# EAGLE board Preselector (EAGLE 7.7.0), part 1 of 2
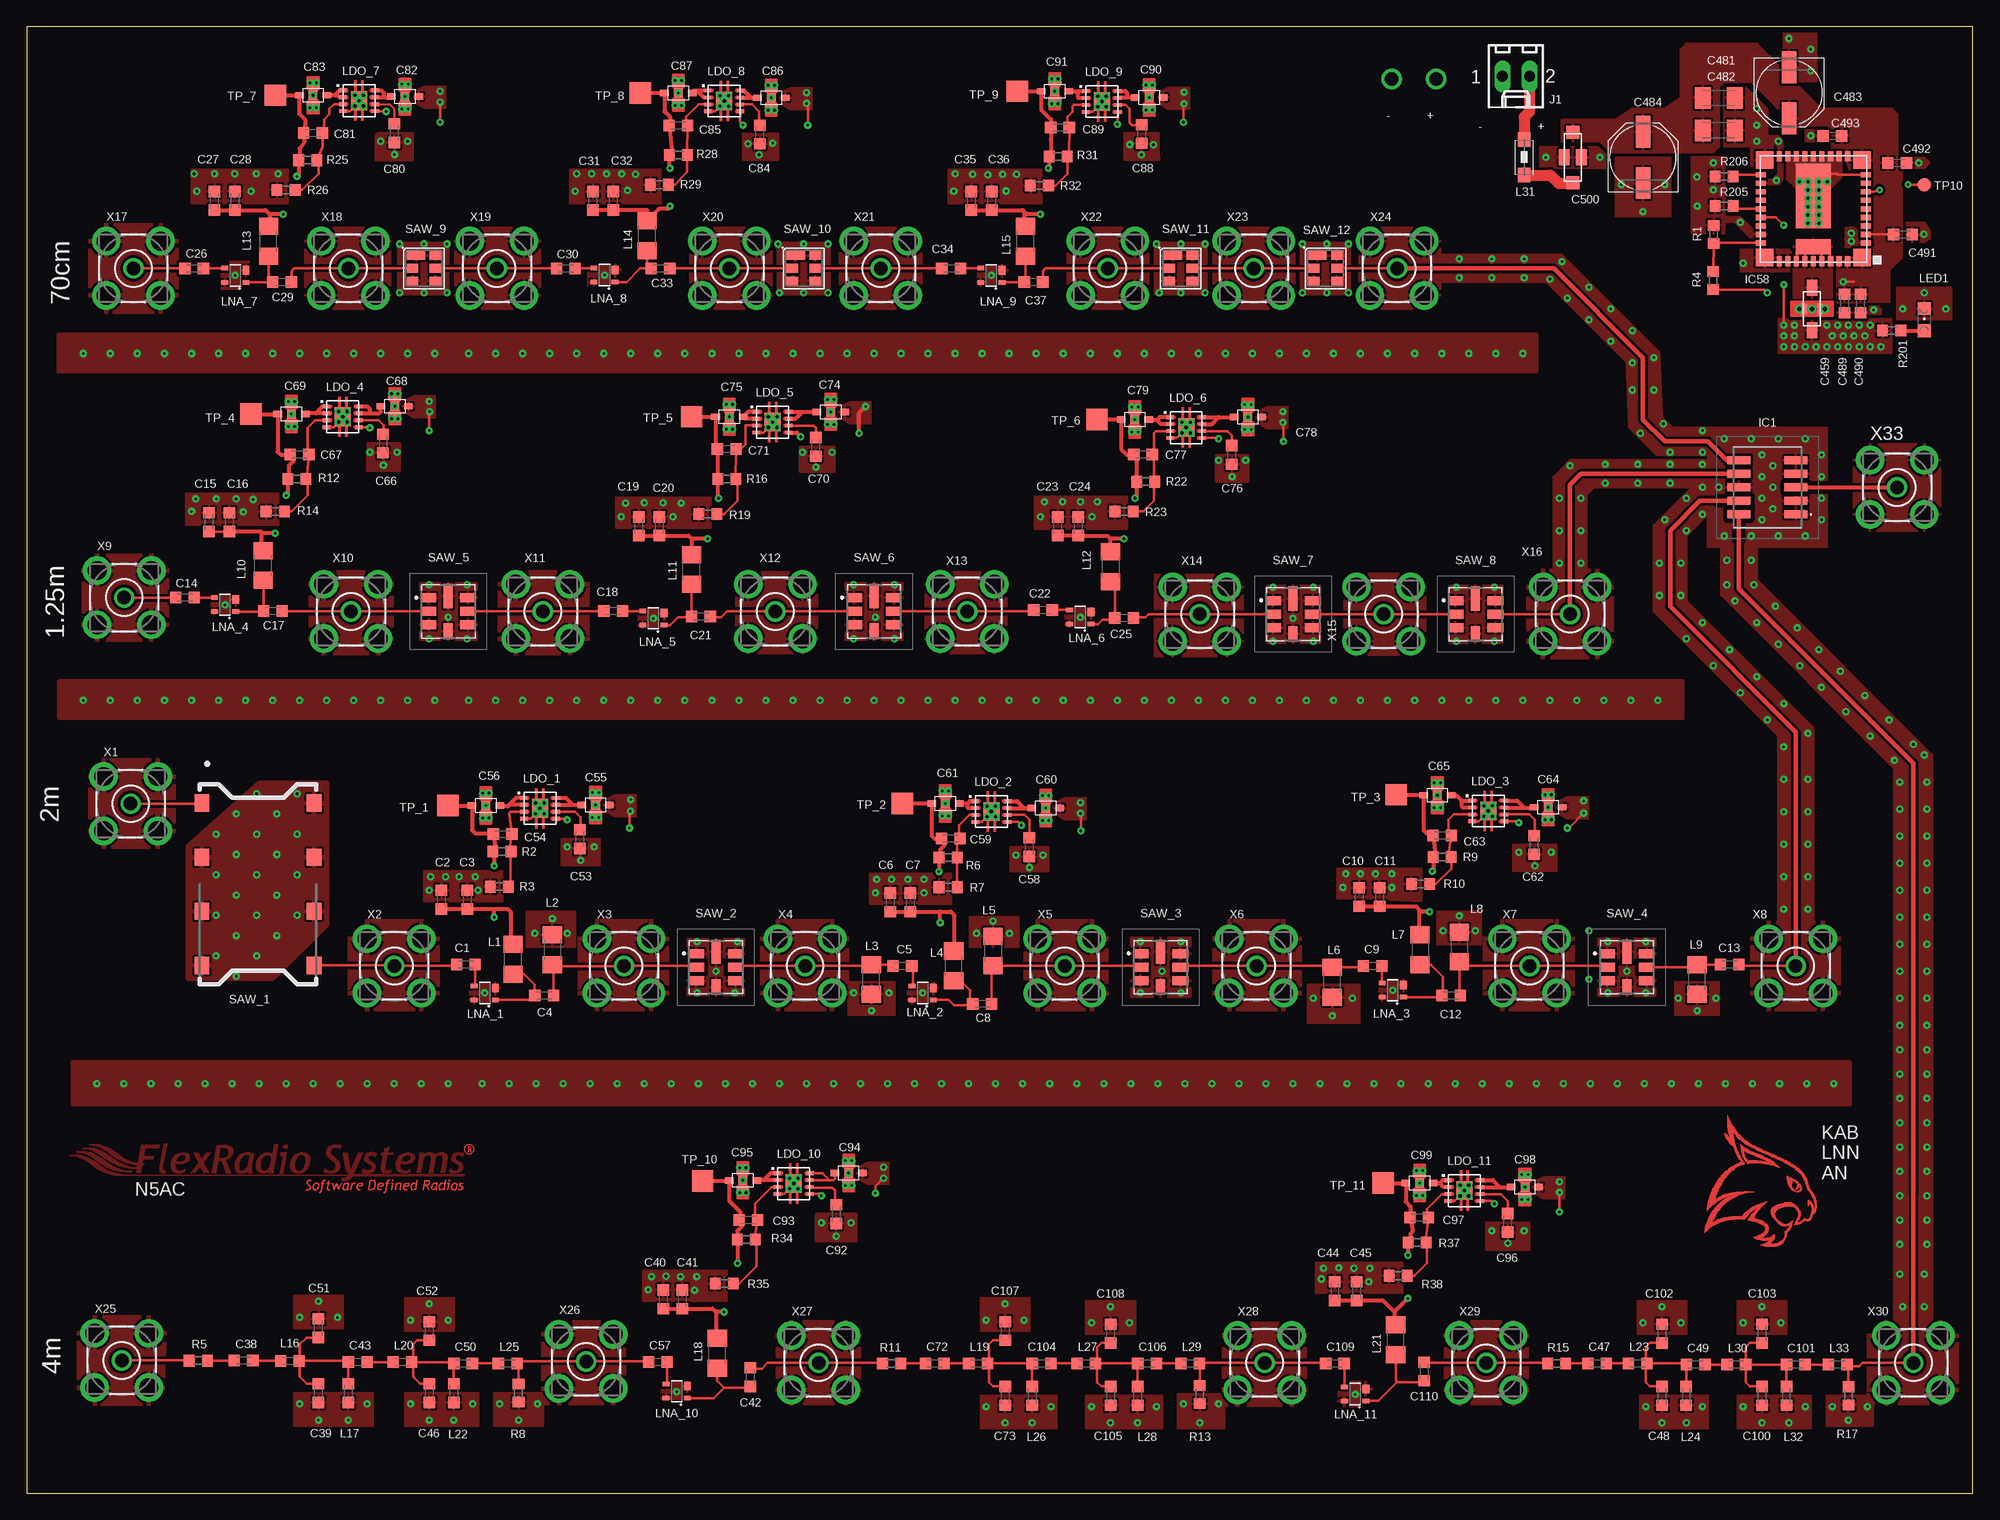
[diagram p5: board, top side]
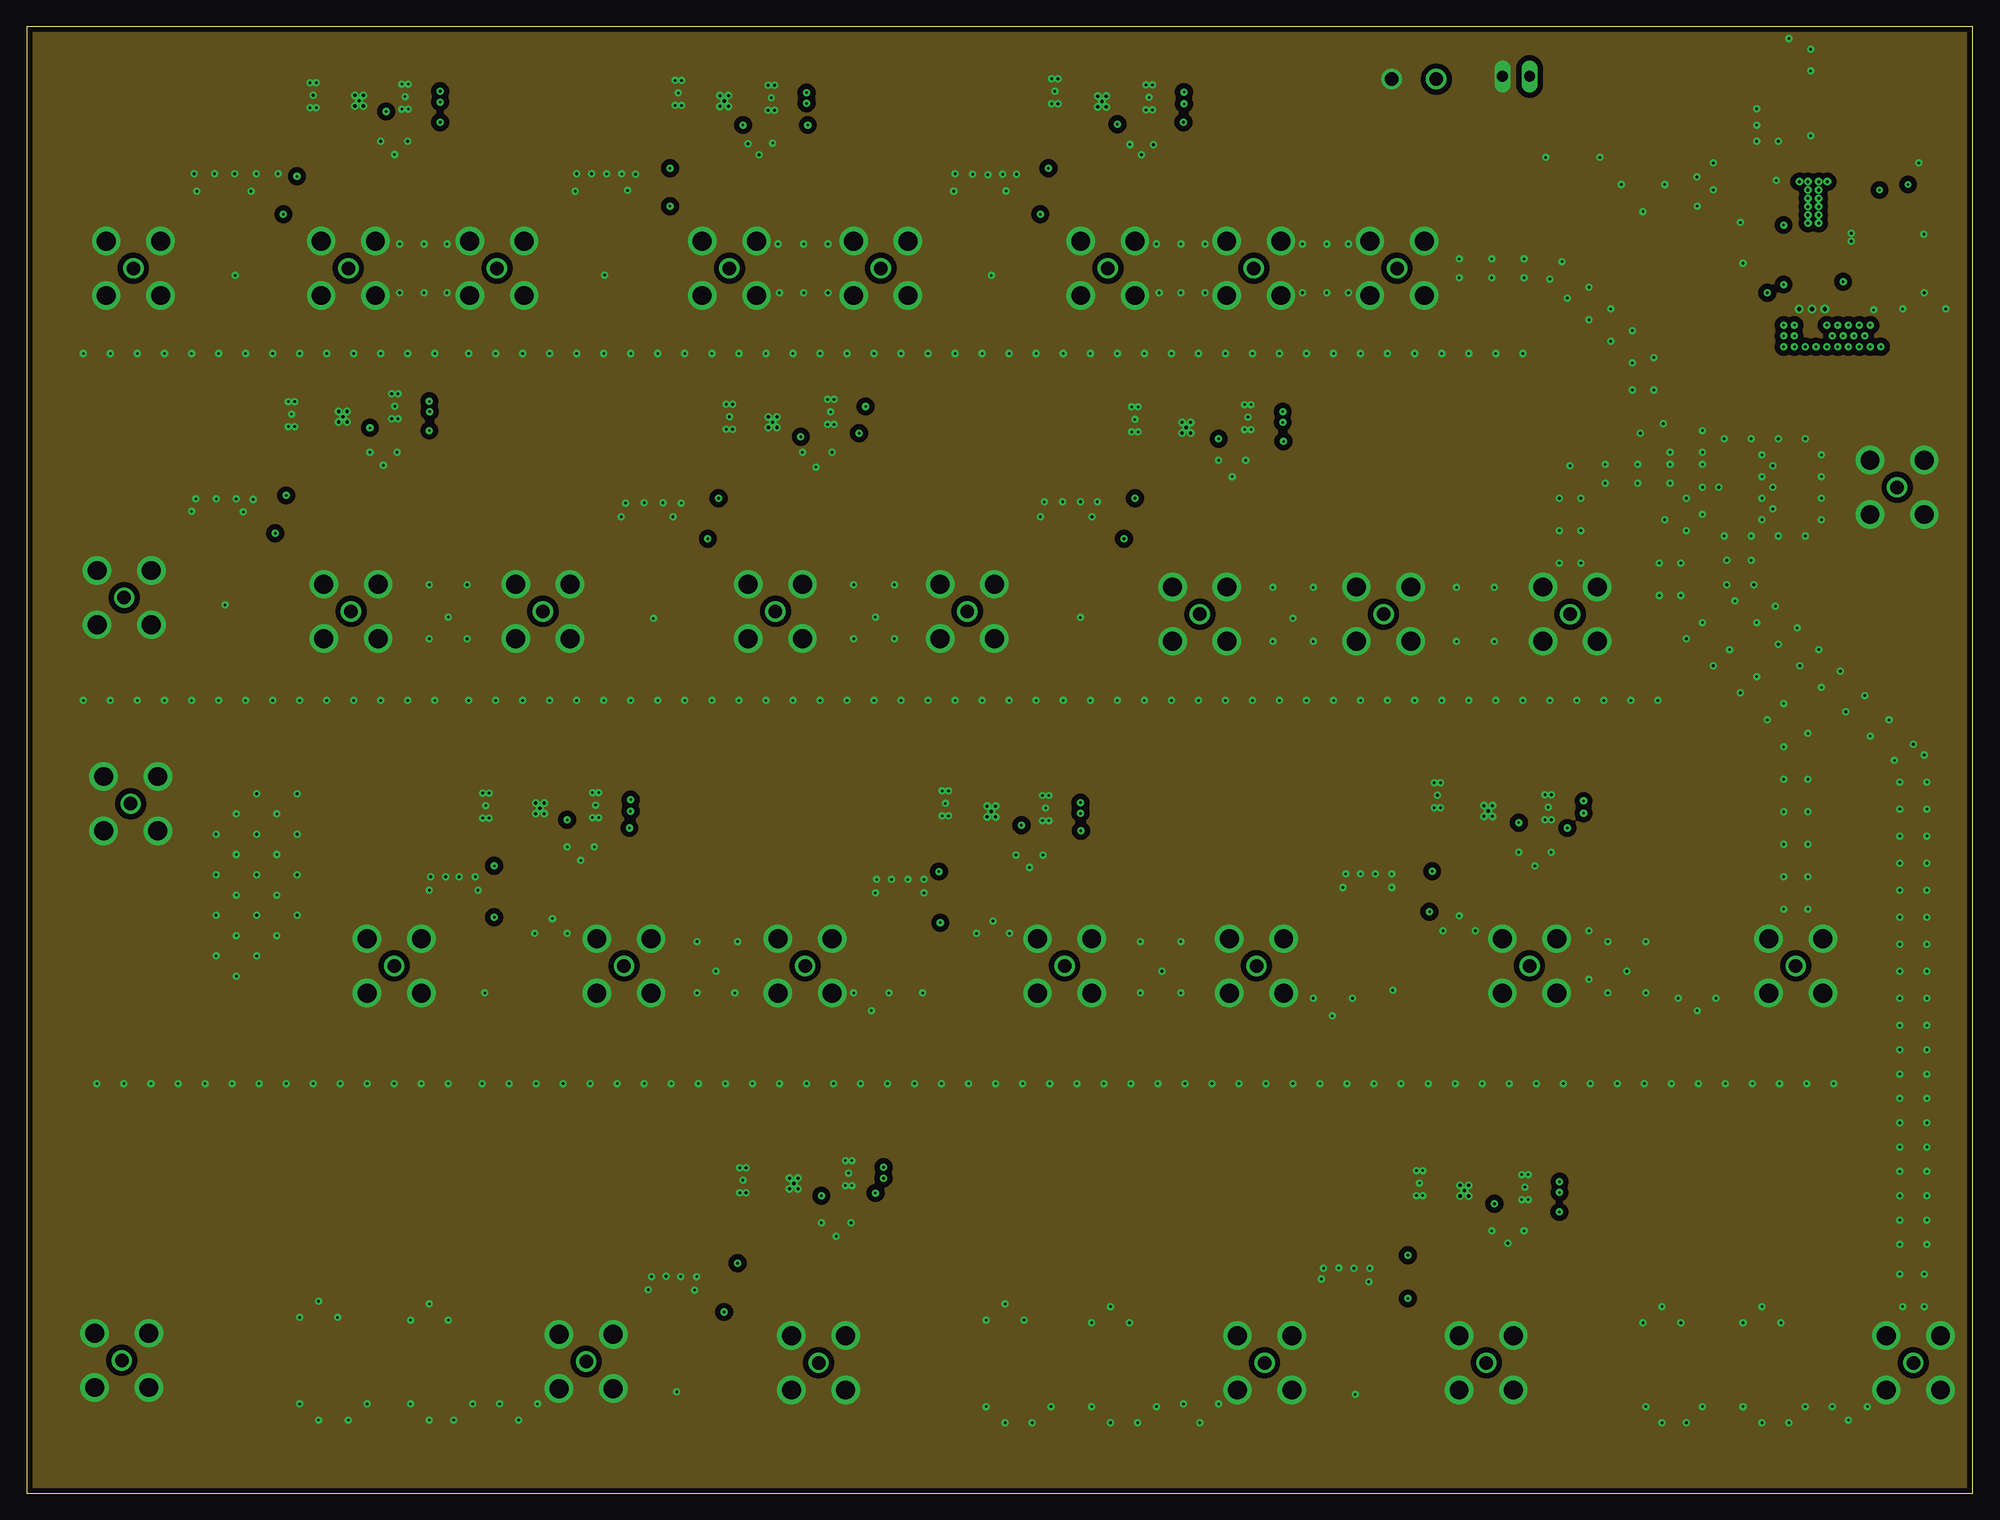
[diagram p6: board, inner layer GND]
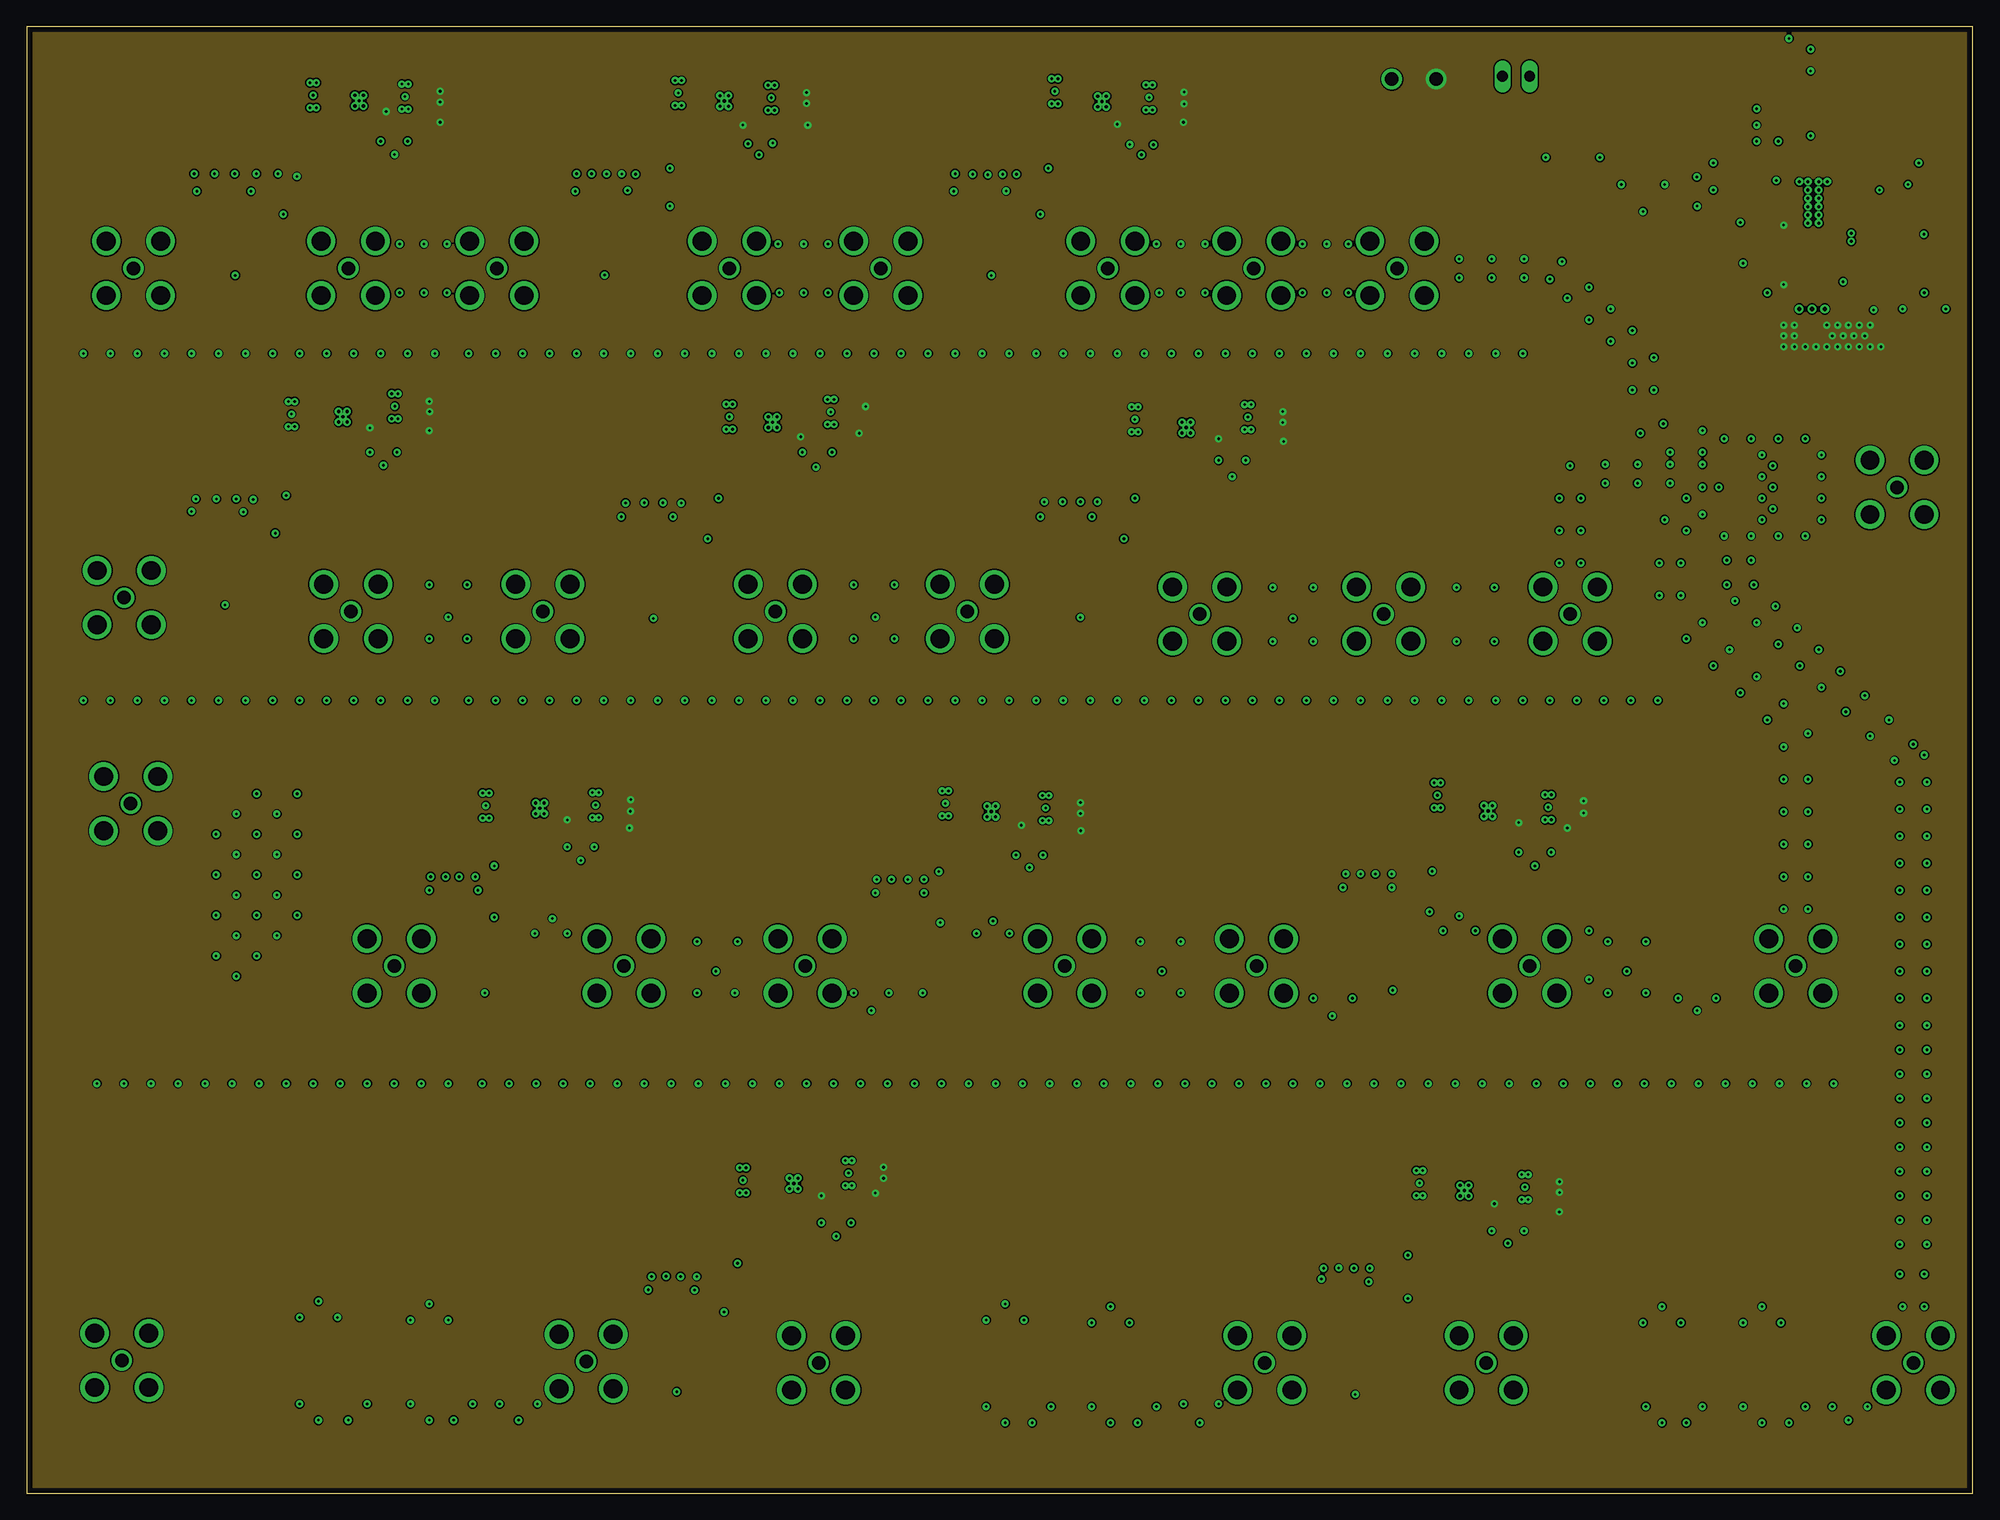
[diagram p7: board, inner layer PWR]
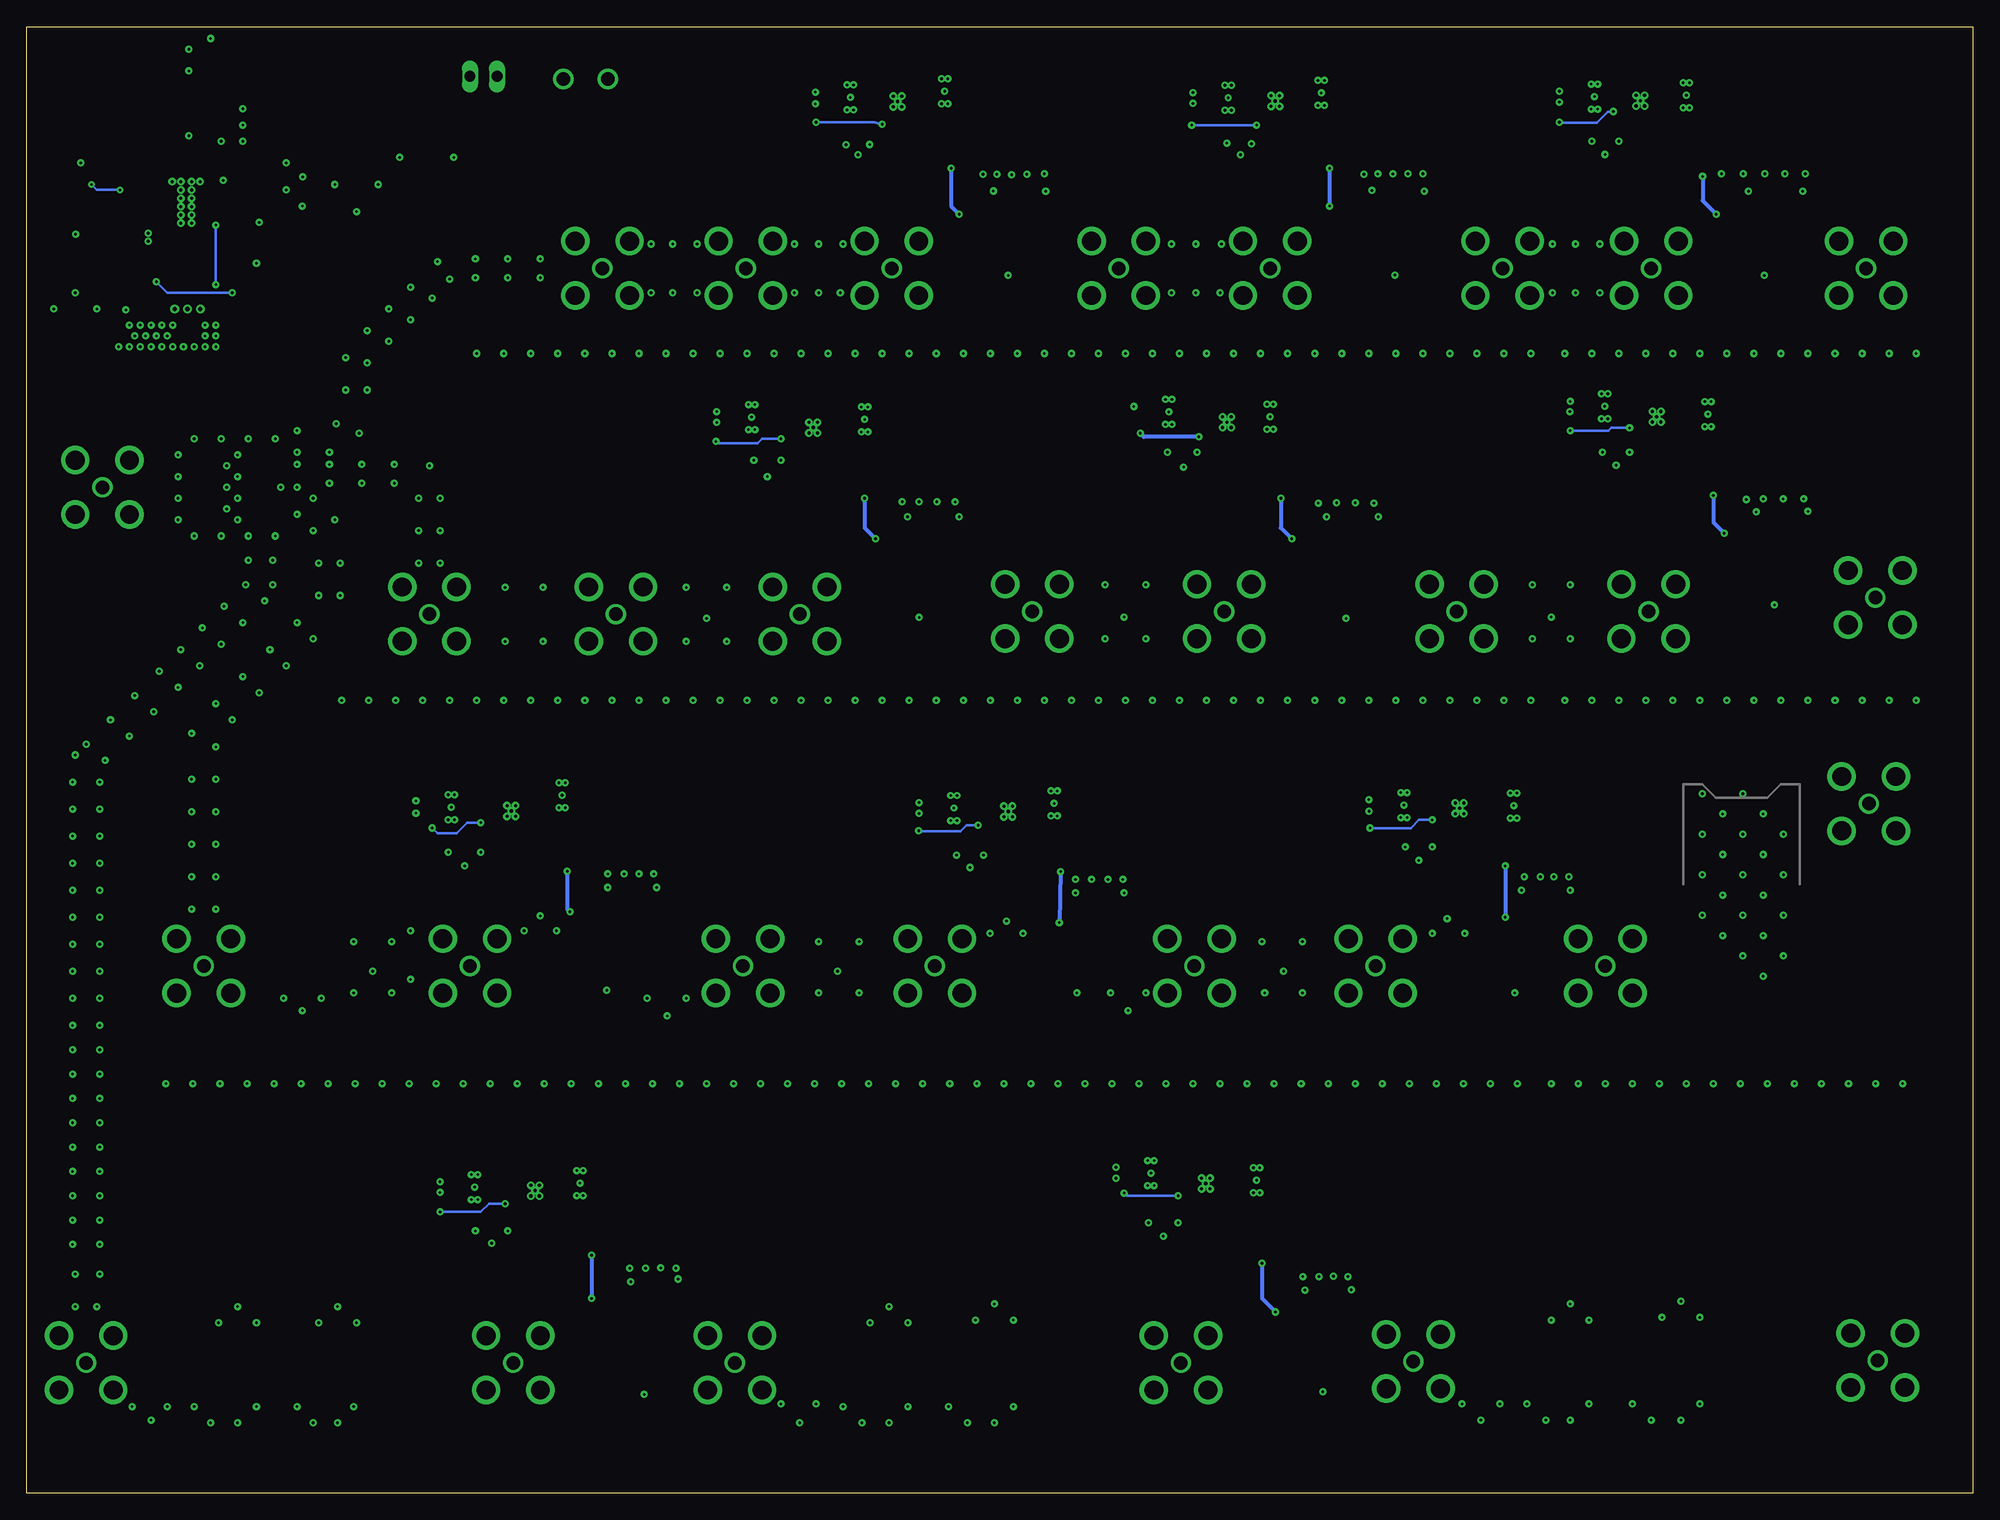
[diagram p8: board, bottom side, seen from below]

Size 182.89 x 137.77 mm. Coordinates in mm from the lower left corner, seen from the top.
Outline: 0,0 182.88,0 182.88,137.77 0,137.77 0,0
Copper layers (1*2+15*16): Top 0.035mm / dielectric 0.15mm / GND 0.035mm / dielectric 0.15mm / PWR 0.035mm / dielectric 0.2mm / Bottom 0.035mm
Design rules "default *": minimum track width 4mil, minimum drill 4mil, track to track 5mil, track to pad 5mil, pad to pad 5mil, via to via 5mil, smd to smd 5mil, copper to edge 20mil, drill to drill 8mil, minimum pad ring 8mil, minimum via ring 8mil, stop-mask expansion 4mil, vias tented up to drill 0mil, thermal gap 8mil
Net classes: 0 default: width 0.102 mm, drill 0.203 mm, clearance 0.102 mm; 1 GND: width 0.203 mm, drill 0.229 mm, clearance 0.203 mm to class 0, clearance 0.203 mm

## Footprints (pad centres in the part's own frame; a part is rotated, then mirrored left to right if it is on the bottom)
C0603K = smd 1.05 x 1.08: 1 -0.875,0; 2 0.875,0
NFM21PS = smd 0.8 x 0.85: GND1 0,0 | smd 1.2 x 0.3: GND2 0,-0.775; GND3 0,0.775 | drill 0.25: GND4 0,0; GND5 -0.3,-1.175; GND6 0.3,-1.175; GND7 0.3,1.175; GND8 -0.3,1.175 | smd 0.8 x 0.6: IN -1.3,0; OUT 1.3,0
NFM31PC276 = smd 1 x 0.5: GND1 0,0.75; GND2 0,-0.75 | drill 0.4: GND3 0,0; GND4 0,1.2; GND5 0,-1.2 | smd 1.5 x 1: IN -2,0; OUT 2,0
C1206K = smd 1.5 x 2: 1 -1.5,0; 2 1.5,0
PANASONIC_D = smd 3 x 1.4: + 2.4,0; - -2.4,0
NFM1806 = smd 1.25 x 1.2: 1 -2.375,0; 2 2.375,0 | smd 1.5 x 1: GND@1 0,-0.8; GND@2 0,0.8
SCA-4-10+ = smd 0.76 x 2.16: 1 -2.54,-2.68; 2 -1.27,-2.68; 3 0,-2.68; 4 1.27,-2.68; 5 2.54,-2.68; 6 2.54,2.68; 7 1.27,2.68; 8 0,2.68; 9 -1.27,2.68; 10 -2.54,2.68
RVQ = smd 1.65 x 1.65: 1 -4.575,-4.575; 11 4.575,-4.575; 21 4.575,4.575; 31 -4.575,4.575 | smd 0.5 x 0.95: 2 -3.2,-4.925; 3 -2.4,-4.925; 4 -1.6,-4.925; 5 -0.8,-4.925; 6 0,-4.925; 7 0.8,-4.925; 8 1.6,-4.925; 9 2.4,-4.925; 10 3.2,-4.925; 22 3.2,4.925; 23 2.4,4.925; 24 1.6,4.925; 25 0.8,4.925; 26 0,4.925; 27 -0.8,4.925; 28 -1.6,4.925; 29 -2.4,4.925; 30 -3.2,4.925 | smd 0.95 x 0.5: 12 4.925,-3.2; 13 4.925,-2.4; 14 4.925,-1.6; 15 4.925,-0.8; 16 4.925,0; 17 4.925,0.8; 18 4.925,1.6; 19 4.925,2.4; 20 4.925,3.2; 32 -4.925,3.2; 33 -4.925,2.4; 34 -4.925,1.6; 35 -4.925,0.8; 36 -4.925,0; 37 -4.925,-0.8; 38 -4.925,-1.6; 39 -4.925,-2.4; 40 -4.925,-3.2 | smd 1.4 x 3.29: 41 -3.55,0 | smd 6.05 x 3.29: 42 1.225,0 | drill 0.3 pad 0.61: 42A -1.35,-0.51; 42B -1.35,0.51; 42C -0.57,-0.51; 42D -0.57,0.51; 42E 0.21,-0.51; 42F 0.21,0.51; 42G 0.99,-0.51; 42H 0.99,0.51; 42J 1.77,-0.51; 42K 1.77,0.51; 42L 2.55,-0.51; 42M 2.55,0.51; 42N 2.55,-1.31; 42P 2.55,1.31
6410-02 = drill 1.016 long: 1 1.27,0; 2 -1.27,0
C1206 = smd 1.6 x 1.8: 1 -1.4,0; 2 1.4,0
1206 = smd 1.35 x 1.2: 1 -1.7,0; 2 1.65,0
DRB = smd 0.35 x 0.65: 1 -0.975,-1.55; 2 -0.325,-1.55; 3 0.325,-1.55; 4 0.975,-1.55; 5 0.975,1.55; 6 0.325,1.55; 7 -0.325,1.55; 8 -0.975,1.55 | drill 0.3 pad 0.406: P1 -0.5,0.4; P2 0.5,0.4; P3 0,0; P4 -0.5,-0.4; P5 0.5,-0.4 | smd 1.75 x 1.5: PAD 0,0
CHIPLED_0805 = smd 1.2 x 1.2: A 0,-1.05; C 0,1.05
SPF-5043Z = smd 0.425 x 0.64: 1 -0.65,-0.995; 3 0.67,1; 4 -0.65,1 | smd 0.8 x 0.64: 2 0.48,-0.995
R0603 = smd 1 x 1.1: 1 -0.85,0; 2 0.85,0
SXBP-140+ = smd 1.626 x 1.397: 1 -7.62,-5.397; 2 -7.62,5.144; 3 -2.54,-5.397; 4 -2.54,5.144; 5 2.54,-5.397; 6 2.54,5.144; 7 7.62,-5.397; 8 7.62,5.144
TA147FD = smd 1.47 x 0.84: 1 -1.865,1.27; 2 -1.865,0; 3 -1.865,-1.27; 5 1.865,-1.27; 6 1.865,0; 7 1.865,1.27 | smd 0.84 x 1.47: 4 0,-1.865 | smd 0.84 x 2.28: 8 0,1.46
TA0576A = smd 1.47 x 0.84: 1 -1.865,1.27; 2 -1.865,0; 3 -1.865,-1.27; 5 1.865,-1.27; 6 1.865,0; 7 1.865,1.27 | smd 0.84 x 1.47: 4 0,-1.865 | smd 0.84 x 2.28: 8 0,1.46
TA1914A = smd 1.7 x 0.81: 1 -0.75,1.195 | smd 1.05 x 0.81: 2 -1.075,0.005; 3 -1.075,-1.185; 4 1.075,-1.185; 5 1.075,0.005; 6 1.075,1.195
B1,27 = smd 1.27 x 1.27: TP 0,0
TP20SQ = smd 2 x 2: TP 0,0
BU-SMA-V = drill 1.27: 1 0,0 | drill 1.778: 2 -2.55,2.55; 3 2.55,2.55; 4 2.55,-2.55; 5 -2.55,-2.55

## Placement (x,y rotation side)
C1  100p  [C0603K]  41.27,49.66 0 top
C2  0.1u  [C0603K]  38.99,55.75 90 top
C3  100p  [C0603K]  41.4,55.75 90 top
C4  8p  [C0603K]  48.64,46.74 0 top
C5  12p  [C0603K]  82.3,49.53 0 top
C6  0.1u  [C0603K]  81.15,55.5 90 top
C7  100p  [C0603K]  83.06,55.5 90 top
C8  8p  [C0603K]  89.79,45.97 180 top
C9  12p  [C0603K]  126.49,49.53 0 top
C10  0.1u  [C0603K]  125.22,56.01 90 top
C11  100p  [C0603K]  127.13,56.01 90 top
C12  8p  [C0603K]  133.86,46.74 0 top
C13  12p  [C0603K]  160.02,49.66 0 top
C14  100p  [C0603K]  14.88,84.12 0 top
C15  0.1u  [C0603K]  17.14,91.21 90 top
C16  100p  [C0603K]  19.05,91.21 90 top
C17  100p  [C0603K]  23.14,82.85 0 top
C18  100p  [C0603K]  55.12,82.85 0 top
C19  0.1u  [C0603K]  57.53,90.83 90 top
C20  100p  [C0603K]  59.44,90.83 90 top
C21  100p  [C0603K]  63.37,82.35 0 top
C22  100p  [C0603K]  95.5,82.96 0 top
C23  0.1u  [C0603K]  96.9,90.83 90 top
C24  100p  [C0603K]  98.81,90.83 90 top
C25  100p  [C0603K]  103.12,82.19 0 top
C26  100p  [C0603K]  15.75,115.06 0 top
C27  0.1u  [C0603K]  17.65,121.41 90 top
C28  100p  [C0603K]  19.56,121.41 90 top
C29  100p  [C0603K]  24,113.79 0 top
C30  100p  [C0603K]  50.67,115.06 0 top
C31  0.1u  [C0603K]  53.21,121.41 90 top
C32  100p  [C0603K]  55.12,121.41 90 top
C33  100p  [C0603K]  59.56,115.06 0 top
C34  100p  [C0603K]  86.87,115.06 0 top
C35  0.1u  [C0603K]  88.77,121.41 90 top
C36  100p  [C0603K]  90.68,121.41 90 top
C37  100p  [C0603K]  94.61,113.79 0 top
C38  4.2p  [C0603K]  20.4,12.45 0 top
C39  650p  [C0603K]  27.43,9.4 270 top
C40  0.1u  [C0603K]  59.82,18.21 90 top
C41  100p  [C0603K]  61.59,18.21 90 top
C42  100p  [C0603K]  68.02,10.9 90 top
C43  1.3p  [C0603K]  31.11,12.32 0 top
C44  0.1u  [C0603K]  122.94,18.97 90 top
C45  100p  [C0603K]  124.97,18.97 90 top
C46  650p  [C0603K]  37.85,9.4 270 top
C47  4.2p  [C0603K]  147.57,12.19 0 top
C48  650p  [C0603K]  153.67,9.14 270 top
C49  1.3p  [C0603K]  156.84,12.06 0 top
C50  4.2p  [C0603K]  41.02,12.19 0 top
C51  650p  [C0603K]  27.43,15.49 90 top
C52  650p  [C0603K]  37.85,15.24 90 top
C53  470n  [C0603K]  51.99,61.44 270 top
C54  470n  [C0603K]  44.73,61.9 180 top
C55  NFM21PS106B0J3D  [NFM21PS]  53.47,64.64 180 top
C56  NFM21PS106B0J3D  [NFM21PS]  43.15,64.59 180 top
C57  100p  [C0603K]  59.31,12.32 0 top
C58  470n  [C0603K]  94.21,60.68 270 top
C59  470n  [C0603K]  86.84,61.49 180 top
C60  NFM21PS106B0J3D  [NFM21PS]  95.76,64.36 180 top
C61  NFM21PS106B0J3D  [NFM21PS]  86.33,64.8 180 top
C62  470n  [C0603K]  141.66,60.88 270 top
C63  470n  [C0603K]  133.02,61.8 180 top
C64  NFM21PS106B0J3D  [NFM21PS]  142.98,64.44 180 top
C65  NFM21PS106B0J3D  [NFM21PS]  132.56,65.56 180 top
C66  470n  [C0603K]  33.5,98.6 270 top
C67  470n  [C0603K]  25.65,97.56 180 top
C68  NFM21PS106B0J3D  [NFM21PS]  34.59,102.11 180 top
C69  NFM21PS106B0J3D  [NFM21PS]  24.89,101.37 180 top
C70  470n  [C0603K]  74.14,98.3 270 top
C71  470n  [C0603K]  65.79,98.07 180 top
C72  4.2p  [C0603K]  85.34,12.19 0 top
C73  650p  [C0603K]  91.95,9.14 270 top
C74  NFM21PS106B0J3D  [NFM21PS]  75.56,101.57 180 top
C75  NFM21PS106B0J3D  [NFM21PS]  66.04,101.12 180 top
C76  470n  [C0603K]  113.26,97.54 270 top
C77  470n  [C0603K]  104.9,97.56 180 top
C78  NFM21PS106B0J3D  [NFM21PS]  114.76,101.09 180 top
C79  NFM21PS106B0J3D  [NFM21PS]  104.14,100.86 180 top
C80  470n  [C0603K]  34.54,127.76 270 top
C81  470n  [C0603K]  26.92,127.76 180 top
C82  NFM21PS106B0J3D  [NFM21PS]  35.56,131.19 180 top
C83  NFM21PS106B0J3D  [NFM21PS]  26.92,131.32 180 top
C84  470n  [C0603K]  68.91,127.64 270 top
C85  470n  [C0603K]  61.24,128.5 180 top
C86  NFM21PS106B0J3D  [NFM21PS]  69.98,131.09 180 top
C87  NFM21PS106B0J3D  [NFM21PS]  61.24,131.55 180 top
C88  470n  [C0603K]  104.78,127.69 270 top
C89  470n  [C0603K]  97.1,128.3 180 top
C90  NFM21PS106B0J3D  [NFM21PS]  105.49,131.11 180 top
C91  NFM21PS106B0J3D  [NFM21PS]  96.62,131.7 180 top
C92  470n  [C0603K]  76.07,26.21 270 top
C93  470n  [C0603K]  67.82,25.65 180 top
C94  NFM21PS106B0J3D  [NFM21PS]  77.24,30.07 180 top
C95  NFM21PS106B0J3D  [NFM21PS]  67.31,29.39 180 top
C96  470n  [C0603K]  139.17,25.4 270 top
C97  470n  [C0603K]  130.86,25.88 180 top
C98  NFM21PS106B0J3D  [NFM21PS]  140.79,28.75 180 top
C99  NFM21PS106B0J3D  [NFM21PS]  130.89,29.13 180 top
C100  650p  [C0603K]  163.07,9.14 270 top
C101  4.2p  [C0603K]  166.24,12.06 0 top
C102  650p  [C0603K]  153.67,14.99 90 top
C103  650p  [C0603K]  163.07,14.99 90 top
C104  1.3p  [C0603K]  95.38,12.19 0 top
C105  650p  [C0603K]  101.85,9.14 270 top
C106  4.2p  [C0603K]  105.28,12.19 0 top
C107  650p  [C0603K]  91.95,15.24 90 top
C108  650p  [C0603K]  101.85,14.99 90 top
C109  100p  [C0603K]  122.94,12.19 0 top
C110  100p  [C0603K]  131.32,11.43 90 top
C459  [NFM31PC276]  167.77,111.25 270 top
C481  33u  [C1206K]  159,131.06 0 top
C482  33u  [C1206K]  159,128.02 0 top
C483  EEE-FK1V470P  [PANASONIC_D]  165.61,131.57 270 top
C484  EEE-FK1V470P  [PANASONIC_D]  151.89,125.48 90 top
C489  .1u 50V  [C0603K]  170.81,111.76 270 top
C490  .1u 50V  [C0603K]  172.34,111.76 270 top
C491  .1u 50V  [C0603K]  176.3,118.24 0 top
C492  .1u 50V  [C0603K]  175.77,124.97 0 top
C493  .1u 50V  [C0603K]  169.67,127.51 180 top
C500  NFM41PC155B1E3  [NFM1806]  145.29,125.48 90 top
IC1  SCA-4-10+  [SCA-4-10+]  163.58,94.49 90 top
IC58  LMZ31707RVQ  [RVQ]  167.89,120.65 90 top
J1  22-27-2021-02  [6410-02]  139.95,133.1 180 top
L1  100n  [C1206]  45.72,50.16 90 top
L2  56n  [C1206]  49.4,51.05 270 top
L3  47n  [C1206]  79.38,48.26 90 top
L4  100n  [C1206]  87.12,49.53 90 top
L5  56n  [C1206]  90.81,50.93 270 top
L6  47n  [C1206]  122.68,48.01 90 top
L7  100n  [C1206]  130.94,51.05 270 top
L8  56n  [C1206]  134.62,51.31 270 top
L9  47n  [C1206]  156.97,48.26 90 top
L10  100n  [C1206]  22.23,87.15 90 top
L11  100n  [C1206]  62.48,86.77 90 top
L12  100n  [C1206]  101.85,87.02 270 top
L13  100n  [C1206]  22.73,117.6 90 top
L14  100n  [C1206]  58.29,118.11 90 top
L15  100n  [C1206]  93.85,117.6 90 top
L16  1.2u  [C0603K]  24.74,12.42 0 top
L17  3.9n  [C0603K]  30.23,9.4 90 top
L18  100n  [C1206]  64.9,13.13 90 top
L19  1.2u  [C0603K]  89.41,12.19 0 top
L20  3.9u  [C0603K]  35.31,12.32 0 top
L21  100n  [C1206]  128.65,14.4 90 top
L22  100n  [C0603K]  40.13,9.4 90 top
L23  1.2u  [C0603K]  151.38,12.19 0 top
L24  3.9n  [C0603K]  155.96,9.14 90 top
L25  1.2u  [C0603K]  45.21,12.19 0 top
L26  3.9n  [C0603K]  94.49,9.14 90 top
L27  3.9u  [C0603K]  99.57,12.19 0 top
L28  100n  [C0603K]  104.39,9.14 90 top
L29  1.2u  [C0603K]  109.35,12.19 0 top
L30  3.9u  [C0603K]  160.66,12.06 0 top
L31  BLM31PG121SN1L  [1206]  140.72,125.48 270 top
L32  100n  [C0603K]  165.35,9.14 90 top
L33  1.2u  [C0603K]  170.18,12.06 0 top
LDO_1  TPS7A8101DRB  [DRB]  48.23,64.34 270 top
LDO_2  TPS7A8101DRB  [DRB]  90.65,64.03 270 top
LDO_3  TPS7A8101DRB  [DRB]  137.34,64.08 270 top
LDO_4  TPS7A8101DRB  [DRB]  29.72,101.12 270 top
LDO_5  TPS7A8101DRB  [DRB]  70.1,100.61 270 top
LDO_6  TPS7A8101DRB  [DRB]  108.97,100.1 270 top
LDO_7  TPS7A8101DRB  [DRB]  31.24,130.81 270 top
LDO_8  TPS7A8101DRB  [DRB]  65.56,130.78 270 top
LDO_9  TPS7A8101DRB  [DRB]  101.04,130.73 270 top
LDO_10  TPS7A8101DRB  [DRB]  72.09,29.08 270 top
LDO_11  TPS7A8101DRB  [DRB]  135.1,28.42 270 top
LED1  LTST-C170GKT  [CHIPLED_0805]  178.31,110.24 0 top
LNA_1  SPF-5043Z  [SPF-5043Z]  43.05,46.99 90 top
LNA_2  SPF-5043Z  [SPF-5043Z]  84.2,46.99 90 top
LNA_3  SPF-5043Z  [SPF-5043Z]  128.37,47.24 90 top
LNA_4  SPF-5043Z  [SPF-5043Z]  18.64,83.46 90 top
LNA_5  SPF-5043Z  [SPF-5043Z]  58.9,82.19 90 top
LNA_6  SPF-5043Z  [SPF-5043Z]  99.01,82.3 90 top
LNA_7  SPF-5043Z  [SPF-5043Z]  19.61,114.4 90 top
LNA_8  SPF-5043Z  [SPF-5043Z]  54.31,114.43 90 top
LNA_9  SPF-5043Z  [SPF-5043Z]  90.65,114.4 90 top
LNA_10  SPF-5043Z  [SPF-5043Z]  61.09,9.58 90 top
LNA_11  SPF-5043Z  [SPF-5043Z]  124.84,9.32 90 top
R1  14k  [R0603]  158.52,118.24 90 top
R2  52.3k  [R0603]  44.68,60.27 0 top
R3  10.0k  [R0603]  44.42,56.97 180 top
R4  68.1k  [R0603]  158.47,113.92 90 top
R5  50  [R0603]  16.13,12.45 180 top
R6  52.3k  [R0603]  86.59,59.72 0 top
R7  10.0k  [R0603]  86.59,56.92 180 top
R8  50  [R0603]  46.23,9.4 90 top
R9  52.3k  [R0603]  133.02,59.77 0 top
R10  10.0k  [R0603]  130.99,57.23 180 top
R11  50  [R0603]  81.28,12.19 180 top
R12  52.3k  [R0603]  25.4,95.28 0 top
R13  50  [R0603]  110.24,9.27 90 top
R14  10.0k  [R0603]  23.37,92.23 180 top
R15  50  [R0603]  143.76,12.19 180 top
R16  52.3k  [R0603]  65.79,95.28 0 top
R17  50  [R0603]  171.2,9.14 90 top
R19  10.0k  [R0603]  64.01,91.97 180 top
R22  52.3k  [R0603]  105.16,95.02 0 top
R23  10.0k  [R0603]  103.12,92.23 180 top
R25  52.3k  [R0603]  26.42,125.22 0 top
R26  10.0k  [R0603]  24.38,122.43 180 top
R28  52.3k  [R0603]  61.24,125.7 0 top
R29  10.0k  [R0603]  59.46,122.91 180 top
R31  52.3k  [R0603]  96.93,125.58 0 top
R32  10.0k  [R0603]  95.17,122.83 180 top
R34  52.3k  [R0603]  67.64,23.83 0 top
R35  10.0k  [R0603]  65.56,19.68 180 top
R37  52.3k  [R0603]  130.66,23.55 0 top
R38  10.0k  [R0603]  128.88,20.42 180 top
R201  560  [R0603]  175.26,109.22 180 top
R205  182  [R0603]  159.51,120.9 0 top
R206  53.6k  [R0603]  159.51,123.7 0 top
SAW_1  SXBP-140+  [SXBP-140+]  21.87,57.2 270 top
SAW_2  TA147FD  [TA147FD]  64.77,49.4 0 top
SAW_3  TA147FD  [TA147FD]  106.55,49.4 0 top
SAW_4  TA147FD  [TA147FD]  150.37,49.4 0 top
SAW_5  TA0576A  [TA0576A]  39.62,82.83 0 top
SAW_6  TA0576A  [TA0576A]  79.63,82.83 0 top
SAW_7  TA0576A  [TA0576A]  119,82.58 0 top
SAW_8  TA0576A  [TA0576A]  136.14,82.58 0 top
SAW_9  TA1914A  [TA1914A]  37.34,115.06 0 top
SAW_10  TA1914A  [TA1914A]  73.03,115.06 0 top
SAW_11  TA1914A  [TA1914A]  108.46,115.06 0 top
SAW_12  TA1914A  [TA1914A]  122.05,115.06 0 top
TP10  TPSQB1,27  [B1,27]  178.31,122.94 0 top
TP_1  TPTP20SQ  [TP20SQ]  39.6,64.59 270 top
TP_2  TPTP20SQ  [TP20SQ]  82.27,64.8 270 top
TP_3  TPTP20SQ  [TP20SQ]  128.7,65.61 270 top
TP_4  TPTP20SQ  [TP20SQ]  21.08,101.37 270 top
TP_5  TPTP20SQ  [TP20SQ]  62.48,101.12 270 top
TP_6  TPTP20SQ  [TP20SQ]  100.58,100.86 270 top
TP_7  TPTP20SQ  [TP20SQ]  23.37,131.32 270 top
TP_8  TPTP20SQ  [TP20SQ]  57.68,131.55 270 top
TP_9  TPTP20SQ  [TP20SQ]  93.09,131.7 270 top
TP_10  TPTP20SQ  [TP20SQ]  63.53,29.34 270 top
TP_11  TPTP20SQ  [TP20SQ]  127.48,29.13 270 top
X1  0733660061  [BU-SMA-V]  9.78,64.77 0 top
X2  0733660061  [BU-SMA-V]  34.54,49.53 0 top
X3  0733660061  [BU-SMA-V]  56.13,49.53 0 top
X4  0733660061  [BU-SMA-V]  73.15,49.53 0 top
X5  0733660061  [BU-SMA-V]  97.54,49.53 0 top
X6  0733660061  [BU-SMA-V]  115.57,49.53 0 top
X7  0733660061  [BU-SMA-V]  141.22,49.53 0 top
X8  0733660061  [BU-SMA-V]  166.24,49.53 0 top
X9  0733660061  [BU-SMA-V]  9.17,84.12 0 top
X10  0733660061  [BU-SMA-V]  30.48,82.83 90 top
X11  0733660061  [BU-SMA-V]  48.51,82.83 90 top
X12  0733660061  [BU-SMA-V]  70.36,82.83 90 top
X13  0733660061  [BU-SMA-V]  88.39,82.83 90 top
X14  0733660061  [BU-SMA-V]  110.24,82.58 90 top
X15  0733660061  [BU-SMA-V]  127.51,82.58 90 top
X16  0733660061  [BU-SMA-V]  145.03,82.58 0 top
X17  0733660061  [BU-SMA-V]  10.03,115.06 0 top
X18  0733660061  [BU-SMA-V]  30.23,115.06 0 top
X19  0733660061  [BU-SMA-V]  44.2,115.06 0 top
X20  0733660061  [BU-SMA-V]  66.04,115.06 0 top
X21  0733660061  [BU-SMA-V]  80.26,115.06 0 top
X22  0733660061  [BU-SMA-V]  101.6,115.06 0 top
X23  0733660061  [BU-SMA-V]  115.32,115.06 0 top
X24  0733660061  [BU-SMA-V]  128.78,115.06 0 top
X25  0733660061  [BU-SMA-V]  8.94,12.47 0 top
X26  0733660061  [BU-SMA-V]  52.58,12.37 0 top
X27  0733660061  [BU-SMA-V]  74.42,12.24 0 top
X28  0733660061  [BU-SMA-V]  116.33,12.24 0 top
X29  0733660061  [BU-SMA-V]  137.16,12.24 0 top
X30  0733660061  [BU-SMA-V]  177.29,12.24 0 top
X33  0733660061  [BU-SMA-V]  175.77,94.49 0 top

## Tracks (layer width: path | path; a pad name or v marks a point on that pad's centre or on a via)
1.25_RF_OUT
  Top 0.254: SAW_8.6 X16.1
  Top 0.429: IC1.7 146.05,95.76 145.03,94.74 X16.1
1.25M_RF_IN
  Top 0.254: X9.1 C14.1
2M_RF_IN
  Top 0.254: X1.1 16.42,64.77 SAW_1.1
2M_RF_OUT
  Top 0.254: X8.1 161.02,49.53 C13.2
  Top 0.429: IC1.9 157.23,93.22 154.43,90.42 154.43,83.31 166.24,71.5 X8.1
4M_RF_OUT
  Top 0.254: R17.2 171.2,11.92 L33.2 171.18,11.94 172.21,11.94 172.52,12.24 X30.1
  Top 0.429: IC1.10 160.9,84.98 177.29,68.58 X30.1
70CM_RF_IN
  Top 0.254: X17.1 C26.1
70CM_RF_OUT
  Top 0.254: SAW_12.5 X24.1 | 159.77,97.03 IC1.6
  Top 0.429: X24.1 143.51,115.06 151.89,106.68 151.89,100.84 153.92,98.81 157.99,98.81 159.77,97.03
+5V3  (via drill 0.25, 1.27)
  Top 0.254: IC58.27 164.38,119.85 v165.1,119.13 | v165.1,113.54 v165.1,109.73 | LDO_10.5 74.51,28.11 v74.68,27.94 | v79.76,28.19 79.76,28.83 v80.52,29.59 | LDO_11.5 137.65,27.45 v137.92,27.18 | v144.02,26.42 144.02,28.22 v144.04,28.25 | LDO_1.5 50.68,63.36 v50.8,63.25 | v56.64,62.48 56.64,63.96 v56.74,64.06 | LDO_2.5 93.15,63.06 v93.47,62.74 | v99.06,62.23 99.06,63.83 v99.03,63.86 | LDO_3.5 140.09,63.11 v140.21,62.99 | v144.78,62.48 144.91,62.48 v146.3,63.88 | LDO_4.5 32.19,100.14 v32.26,100.08 | v37.85,99.82 37.85,101.58 v37.87,101.6 | LDO_6.5 111.95,99.13 v112.01,99.06 | v118.11,98.81 118.11,100.51 v118.03,100.58 | LDO_7.5 33.74,129.84 v33.78,129.79 | v38.86,128.78 v38.86,130.68 | LDO_8.5 67.02,128.81 v67.31,128.52 | v73.41,128.52 73.41,130.43 v73.28,130.56 | LDO_9.5 102.51,128.89 v102.49,128.6 | v108.71,128.78 108.71,130.45 v108.76,130.5
  Top 0.356: LDO_5.5 72.35,99.63 v72.75,99.24 | v78.23,99.57 78.23,101.47 v78.84,102.08
  Bottom 0.254: v165.1,119.13 v165.1,113.54 | v74.68,27.94 79.5,27.94 v79.76,28.19 | v137.92,27.18 139.45,27.18 140.21,26.42 v144.02,26.42 | v50.8,63.25 52.07,63.25 52.83,62.48 v56.64,62.48 | v93.47,62.74 94.56,62.74 95.12,62.18 99.01,62.18 v99.06,62.23 | v140.21,62.99 141.48,62.99 142.49,61.98 144.27,61.98 v144.78,62.48 | v32.26,100.08 33.98,100.08 34.24,99.82 v37.85,99.82 | v112.01,99.06 113.77,99.06 114.2,98.63 117.93,98.63 v118.11,98.81 | v33.78,129.79 34.29,129.79 35.33,128.75 38.84,128.75 v38.86,128.78 | v67.31,128.52 v73.41,128.52 | v102.49,128.6 102.67,128.6 103.2,128.8 v108.71,128.78
  Bottom 0.356: v72.75,99.24 77.9,99.24 v78.23,99.57
  other vias: 80.52,30.61 56.77,65.15 144.04,29.26 99.03,64.87 118.03,101.6 108.76,131.62 166.12,109.73 165.1,108.71 166.12,108.71 165.1,107.7 166.12,107.7 167.13,107.7 168.15,107.7 169.16,107.7 170.18,107.7 171.2,107.7 172.21,107.7 173.23,107.7 174.24,107.7 172.72,108.71 173.23,109.73 172.21,109.73 171.2,109.73 170.18,109.73 169.16,109.73 169.67,108.71 170.69,108.71 171.7,108.71 73.28,131.57 38.86,131.7 146.3,65.02 132.46,132.84 37.85,102.57
  pour Top (isolate 0.254): 164.59,110.36 175.26,110.36 175.26,107.06 164.59,107.06
  pour PWR: 0,0 0,137.67 182.88,137.67 182.88,0
  pour Top: 77.98,30.61 78.99,31.11 81.03,31.11 81.03,28.96 78.99,28.96 77.98,29.59
  pour Top: 54.23,65.15 55.24,65.66 57.28,65.66 57.28,63.5 55.24,63.5 54.23,64.14
  pour Top: 141.5,29.26 142.52,29.77 144.55,29.77 144.55,27.61 142.52,27.61 141.5,28.24
  pour Top: 96.49,64.87 97.51,65.38 99.54,65.38 99.54,63.22 97.51,63.22 96.49,63.86
  pour Top: 143.71,64.95 144.73,65.46 146.76,65.46 146.76,63.3 144.73,63.3 143.71,63.93
  pour Top: 35.33,102.62 36.35,103.12 38.38,103.12 38.38,100.97 36.35,100.97 35.33,101.6
  pour Top: 76.3,102.08 77.32,102.59 79.35,102.59 79.35,100.43 77.32,100.43 76.3,101.07
  pour Top: 115.49,101.6 116.51,102.11 118.54,102.11 118.54,99.95 116.51,99.95 115.49,100.58
  pour Top (isolate 0.254, rank 2): 106.22,131.62 107.24,132.13 109.27,132.13 109.27,129.97 107.24,129.97 106.22,130.61
  pour Top (isolate 0.254, rank 2): 70.74,131.57 71.75,132.08 73.79,132.08 73.79,129.92 71.75,129.92 70.74,130.56
  pour Top (isolate 0.254, rank 2): 36.32,131.7 37.34,132.21 39.37,132.21 39.37,130.05 37.34,130.05 36.32,130.68
+13.8V_SW_FIL  (via drill 0.25)
  Top 0.254: IC58.3 175.69,118.25 C491.1 | R4.1 163.28,113.07 v163.58,112.78 | v170.69,113.79 171.7,113.79
  Bottom 0.254: v163.58,112.78 169.67,112.78 v170.69,113.79
  pour Top (isolate 0.254): 144.27,127 147.83,127 148.84,125.98 158.5,125.98 159,126.49 159,132.08 159.51,132.59 162.05,132.59 166.12,128.52 169.16,128.52 169.67,128.02 169.67,125.98 170.81,125.98 171.32,124.33 175.77,124.46 175.77,129.54 175.26,130.05 168.66,130.05 162.56,136.14 155.96,136.14 155.45,135.64 155.45,131.06 153.92,130.05 150.88,130.05 149.35,129.03 144.27,129.03
  pour Top (isolate 0.254, rank 2): 170.05,116.2 170.05,111.76 175.13,111.89 175.13,114.94 176.28,116.08 176.28,125.22 172.34,125.22 172.34,117.86 173.35,117.86 173.48,117.73 173.48,117.09 173.35,116.97 172.59,116.97 172.59,116.2
+13.8V_TPS
  Top 1.016: J1.2 141.22,129.79 140.72,129.29 L31.1
FLEXR
  pour Top (rank 2): 4.14,31.79 4.67,31.79 5.06,31.78 5.16,31.75 5.49,31.66 5.91,31.48 6.43,31.16 6.83,30.83 7.21,30.58 7.58,30.37 8.15,30.14 8.75,29.98 9.26,29.93 30.25,29.93 30.3,29.94 30.33,29.98 30.3,30.02 30.19,30.09 30.1,30.21 30.04,30.38 29.75,31.99 30.12,31.98 30.33,30.52 30.38,30.45 30.46,30.4 30.52,30.39 31.21,32 31.58,31.98 30.7,29.94 41.1,29.95 41.09,29.78 30.59,29.78 30.49,29.6 30.33,29.44 30.12,29.34 29.84,29.29 29.65,29.3 29.65,29.62 29.81,29.62 30.06,29.68 30.18,29.78 9.17,29.79 8.64,29.8 8.35,29.83 7.94,29.89 7.6,29.99 7.23,30.14 7.1,30.19 6.85,30.31 6.54,30.52 6.43,30.59 6.07,30.89 5.59,31.2 5.22,31.41 4.81,31.55 4.57,31.63 4.15,31.66 4.11,31.69 4.14,31.78
  pour Top: 4.74,32 4.7,32.04 4.7,32.09 4.74,32.14 4.82,32.14 5.4,32.13 5.53,32.12 5.75,32.09 6.06,32 6.32,31.88 6.65,31.71 7.05,31.46 7.42,31.18 7.68,30.99 7.89,30.84 8.27,30.65 8.69,30.48 8.99,30.4 9.22,30.34 9.54,30.3 9.76,30.28 9.84,30.25 9.87,30.21 9.87,30.18 9.82,30.14 9.72,30.13 9.25,30.14 8.76,30.19 8.29,30.29 7.77,30.48 7.37,30.69 6.98,30.96 6.55,31.29 6.27,31.49 5.92,31.68 5.59,31.83 5.16,31.95 4.86,32 4.8,32
  pour Top: 5.38,32.33 5.34,32.35 5.32,32.38 5.33,32.41 5.36,32.45 6.21,32.45 6.35,32.43 6.72,32.31 7.04,32.18 7.36,31.98 7.67,31.78 8.08,31.46 8.36,31.26 8.71,31.07 8.93,30.98 9.18,30.86 9.48,30.77 9.75,30.68 10.22,30.61 10.44,30.6 10.46,30.82 10.21,30.82 9.9,30.88 9.46,30.98 9.13,31.09 8.58,31.36 8.28,31.54 7.96,31.79 7.75,31.98 7.44,32.18 7.16,32.33 6.71,32.53 6.39,32.63 6.22,32.66 6,32.66 5.94,32.69 5.92,32.72 5.92,32.77 5.95,32.79 6.76,32.79 7.02,32.74 7.44,32.56 7.8,32.41 8.16,32.16 8.55,31.88 8.9,31.6 9.47,31.3 9.94,31.13 10.32,31.03 10.5,31 10.8,32.72 12.44,32.71 12.39,32.42 11.09,32.42 10.95,31.65 11.89,31.64 11.86,31.37 10.9,31.36 10.85,31.01 10.86,30.96 10.91,30.96 10.99,30.95 11.03,30.92 11,30.85 10.97,30.83 10.87,30.8 10.8,30.77 10.68,30.07 10.33,30.09 10.4,30.45 10.13,30.46 9.73,30.48 9.32,30.55 8.9,30.64 8.46,30.8 8.1,30.97 7.7,31.22 7.41,31.43 7.15,31.63 6.93,31.79 6.69,31.92 6.47,32.04 6.17,32.17 5.89,32.27 5.61,32.32
  pour Top: 12.92,32.79 12.9,32.79 12.47,30.51 12.47,30.42 12.48,30.33 12.53,30.21 12.59,30.16 12.67,30.11 12.78,30.07 12.91,30.05 13.02,30.04 13.06,30.26 12.94,30.28 12.87,30.31 12.83,30.36 12.8,30.44 12.79,30.52 12.81,30.68 13.23,32.8
  pour Top: 14,31.76 14.15,31.88 14.33,31.95 14.55,32 14.74,32.01 14.92,31.99 15.07,31.93 15.18,31.85 15.28,31.71 15.3,31.57 15.29,31.43 15.25,31.28 15.17,31.17 15.06,31.08 14.95,31.02 14.71,30.93 14.53,30.9 14.34,30.9 14.15,30.92 14.01,30.95 13.98,30.99 14.05,31.19 14.17,31.16 14.41,31.13 14.63,31.17 14.82,31.24 14.95,31.34 15.02,31.46 15.02,31.55 14.97,31.67 14.9,31.72 14.8,31.76 14.73,31.77 14.64,31.76 14.53,31.74 14.45,31.72 14.36,31.69 14.29,31.62 14.15,31.49 14.08,31.4 14.01,31.3 13.91,31.01 13.92,30.92 13.91,30.82 13.92,30.72 13.96,30.59 13.99,30.51 14.05,30.43 14.14,30.37 14.24,30.31 14.34,30.29 14.46,30.28 14.6,30.29 14.68,30.31 14.8,30.38 14.86,30.41 14.82,30.14 14.73,30.11 14.6,30.07 14.47,30.05 14.31,30.04 14.17,30.05 14.07,30.07 13.93,30.12 13.86,30.17 13.77,30.25 13.7,30.37 13.64,30.52 13.6,30.7 13.6,30.84 13.61,31.01 13.64,31.19 13.68,31.33 13.76,31.5 13.86,31.62 13.91,31.69
  pour Top: 15.72,31.99 16.08,31.99 16.38,31.36 16.4,31.34 16.43,31.38 16.91,31.98 17.32,31.98 16.57,31.06 16.59,31.01 16.6,31 17.09,30.08 16.68,30.07 16.34,30.75 15.79,30.08 15.42,30.07 16.2,31.06 15.75,31.92
  pour Top: 17.42,30.08 17.89,32.7 18.46,32.72 18.67,32.71 18.83,32.7 19,32.66 19.15,32.58 19.25,32.47 19.35,32.35 19.38,32.19 19.38,32.1 19.36,31.97 19.32,31.82 19.25,31.69 19.17,31.59 19.06,31.47 18.97,31.41 18.88,31.35 18.77,31.31 18.68,31.28 19.18,30.07 18.81,30.07 18.4,31.22 18.03,31.22 18.06,31.5 18.48,31.48 18.66,31.55 18.85,31.62 18.99,31.77 19.03,31.91 19.04,32.09 19.01,32.21 18.92,32.33 18.83,32.38 18.69,32.42 18.58,32.44 18.47,32.45 18.35,32.44 18.24,32.43 18.19,32.4 18.15,32.37 17.76,30.07 17.59,30.07
  pour Top: 19.59,30.77 19.62,30.91 19.63,31.05 19.66,31.18 19.77,31.42 19.88,31.58 20.02,31.74 20.13,31.85 20.33,31.93 20.5,31.99 20.66,32.02 20.86,32.01 21.04,31.98 21.19,31.95 21.34,31.88 21.12,30.78 21.09,30.65 21.09,30.54 21.11,30.38 21.14,30.21 21.19,30.07 20.85,30.07 20.83,30.21 20.82,30.8 21.02,31.69 20.96,31.72 20.88,31.75 20.78,31.78 20.69,31.78 20.64,31.78 20.57,31.78 20.44,31.73 20.34,31.67 20.25,31.6 20.14,31.48 20.08,31.38 20.03,31.28 19.96,31.1 19.95,31 19.93,30.88 19.91,30.73 19.91,30.6 19.94,30.47 19.99,30.4 20.05,30.34 20.15,30.3 20.28,30.27 20.39,30.3 20.52,30.36 20.59,30.43 20.66,30.51 20.72,30.6 20.76,30.73 20.75,30.21 20.61,30.12 20.49,30.07 20.36,30.03 20.11,30.04 19.96,30.06 19.84,30.11 19.74,30.21 19.68,30.28 19.64,30.39 19.62,30.51 19.6,30.63
  pour Top: 21.63,31.14 21.65,31.27 21.69,31.38 21.79,31.53 21.89,31.65 21.99,31.76 22.12,31.85 22.29,31.93 22.45,31.99 22.66,32.01 22.8,32 22.9,31.95 22.97,31.92 23.05,31.86 23.11,31.79 23.29,32.79 23.58,32.78 23.1,30.07 22.8,30.07 22.83,30.21 22.81,30.26 22.76,30.22 22.67,30.15 22.57,30.11 22.36,30.05 22.14,30.04 21.96,30.08 21.84,30.14 21.76,30.23 21.67,30.35 21.62,30.52 21.6,30.65 21.59,30.79 21.61,30.99 21.95,30.99 21.93,30.84 21.93,30.7 21.96,30.56 22.02,30.45 22.1,30.37 22.21,30.3 22.33,30.28 22.43,30.27 22.54,30.31 22.64,30.38 22.71,30.45 22.81,30.58 22.89,30.73 22.93,30.84 22.98,31.11 23.03,31.39 23.03,31.51 22.99,31.59 22.9,31.68 22.79,31.74 22.65,31.76 22.54,31.75 22.45,31.72 22.33,31.66 22.22,31.57 22.14,31.46 22.06,31.35 22,31.24 21.96,31.09 21.95,31.04 21.61,31.04
  pour Top: 23.81,31.74 24.1,31.74 23.79,30.07 24.1,30.07 24.44,31.98 23.87,31.98 23.84,31.88
  pour Top: 24.16,32.4 24.12,32.44 24.11,32.5 24.12,32.58 24.15,32.65 24.22,32.7 24.32,32.73 24.42,32.71 24.47,32.66 24.52,32.59 24.52,32.49 24.49,32.42 24.42,32.35 24.33,32.33 24.27,32.33
  pour Top: 25.19,31.76 25.26,31.81 25.36,31.88 25.48,31.95 25.64,31.99 25.79,32.02 25.96,32.02 26.09,32 26.23,31.96 26.37,31.88 26.46,31.79 26.54,31.67 26.57,31.53 26.59,31.4 26.59,31.24 26.57,31.09 26.55,30.92 26.5,30.75 26.43,30.61 26.35,30.45 26.22,30.33 26.09,30.21 25.95,30.11 25.78,30.06 25.62,30.04 25.44,30.04 25.3,30.05 25.13,30.11 25.04,30.18 24.93,30.31 24.85,30.48 24.83,30.63 24.83,30.93 24.85,31.13 24.94,31.38 25.07,31.62 25.43,31.58 25.35,31.47 25.27,31.34 25.2,31.17 25.17,31.04 25.13,30.85 25.15,30.63 25.18,30.49 25.26,30.38 25.35,30.32 25.47,30.28 25.62,30.27 25.77,30.31 25.9,30.38 26.02,30.48 26.09,30.6 26.19,30.85 26.25,31.1 26.26,31.31 26.24,31.5 26.16,31.64 26.04,31.72 25.92,31.76 25.74,31.77 25.58,31.73 25.51,31.67 25.48,31.63 25.09,31.65
  pour Top: 27.97,30.16 28.07,30.47 28.16,30.42 28.26,30.37 28.36,30.33 28.51,30.3 28.63,30.3 28.78,30.31 28.91,30.37 29,30.45 29.06,30.54 29.09,30.67 29.11,30.79 29.08,30.89 29.01,30.99 28.94,31.08 28.83,31.18 28.7,31.27 28.51,31.43 28.42,31.51 28.31,31.62 28.24,31.76 28.21,31.88 28.21,32.05 28.21,32.16 28.24,32.28 28.3,32.42 28.4,32.52 28.54,32.63 28.68,32.7 28.83,32.74 29.03,32.75 29.24,32.74 29.45,32.72 29.54,32.68 29.41,32.35 29.32,32.41 29.19,32.45 29.04,32.47 28.91,32.47 28.78,32.44 28.68,32.38 28.61,32.29 28.55,32.2 28.54,32.05 28.54,31.92 28.61,31.83 28.94,31.5 29.06,31.43 29.14,31.34 29.22,31.27 29.29,31.18 29.36,31.06 29.4,30.94 29.41,30.78 29.39,30.6 29.36,30.45 29.25,30.28 29.12,30.18 29,30.11 28.8,30.05 28.56,30.04 28.35,30.04 28.19,30.08 28.07,30.12
  pour Top: 32.92,31.89 32.73,31.96 32.52,32 32.41,32 32.3,32.01 32.21,31.98 32.1,31.95 32.01,31.92 31.93,31.87 31.86,31.8 31.79,31.71 31.74,31.6 31.72,31.4 31.74,31.29 31.79,31.2 31.87,31.13 32.01,31.03 32.25,30.91 32.38,30.82 32.44,30.74 32.47,30.65 32.47,30.57 32.44,30.49 32.39,30.4 32.28,30.33 32.18,30.3 32.03,30.28 31.91,30.31 31.8,30.35 31.65,30.47 31.49,30.19 31.57,30.14 31.69,30.08 31.82,30.05 31.95,30.05 32.14,30.05 32.3,30.08 32.45,30.13 32.55,30.19 32.69,30.33 32.73,30.4 32.79,30.58 32.79,30.72 32.76,30.84 32.72,30.93 32.64,31.01 32.5,31.1 32.37,31.15 32.25,31.24 32.14,31.31 32.07,31.4 32.05,31.49 32.07,31.58 32.12,31.65 32.21,31.72 32.32,31.76 32.43,31.77 32.54,31.74 32.61,31.71 32.78,31.62
  pour Top: 33.38,31.99 33.61,31.99 33.7,32.4 34.06,32.53 33.92,31.97 34.46,31.99 34.41,31.77 33.85,31.75 33.83,31.55 33.75,31.2 33.65,30.72 33.63,30.61 33.63,30.54 33.64,30.47 33.69,30.4 33.74,30.34 33.82,30.31 33.92,30.29 34,30.3 34.11,30.32 34.2,30.36 34.2,30.1 34.13,30.07 34,30.04 33.85,30.04 33.63,30.04 33.54,30.07 33.46,30.11 33.4,30.19 33.36,30.28 33.33,30.37 33.32,30.49 33.34,30.67 33.36,30.8 33.56,31.75 33.33,31.76 33.36,31.91
  pour Top: 34.74,31.02 34.76,31.11 34.8,31.25 34.86,31.38 34.93,31.54 35.05,31.69 35.17,31.8 35.32,31.89 35.45,31.95 35.6,32 35.76,32.02 35.91,32.01 36.09,32 36.23,31.95 36.32,31.89 36.39,31.78 36.44,31.64 36.45,31.49 36.44,31.38 36.39,31.27 36.33,31.18 36.25,31.1 36.09,31.01 35.94,30.94 35.77,30.91 35.64,30.89 35.44,30.89 35.31,30.91 35.2,30.94 35.13,30.98 35.19,31.2 35.35,31.17 35.53,31.15 35.7,31.15 35.83,31.18 35.98,31.25 36.08,31.34 36.13,31.41 36.14,31.53 36.12,31.65 36.07,31.7 36,31.72 35.93,31.74 35.83,31.76 35.72,31.75 35.64,31.73 35.55,31.7 35.45,31.65 35.39,31.6 35.32,31.52 35.24,31.43 35.19,31.34 35.17,31.27 35.06,30.94 35.06,30.71 35.08,30.61 35.12,30.52 35.2,30.44 35.27,30.38 35.34,30.33 35.43,30.3 35.53,30.29 35.69,30.29 35.8,30.31 35.88,30.35 36,30.41 35.98,30.12 35.83,30.08 35.74,30.06 35.6,30.05 35.4,30.04 35.27,30.05 35.15,30.09 35.03,30.14 34.92,30.21 34.87,30.29 34.83,30.37 34.79,30.51 34.76,30.65 34.73,30.8 34.73,30.9
  pour Top: 36.68,30.08 36.94,31.53 36.94,31.57 36.94,31.67 36.93,31.79 36.92,31.92 36.91,31.96 37.21,32.02 37.23,31.91 37.24,31.83 37.25,31.77 37.3,31.84 37.37,31.89 37.47,31.93 37.61,31.98 37.72,32 37.83,32.02 37.99,32.01 38.12,31.97 38.22,31.92 38.3,31.85 38.39,31.75 38.48,31.84 38.61,31.92 38.73,31.97 38.84,32 39.02,32.02 39.15,32.01 39.3,31.95 39.39,31.88 39.45,31.79 39.5,31.69 39.5,31.53 39.5,31.46 39.26,30.08 38.94,30.08 39.16,31.22 39.16,31.42 39.15,31.52 39.12,31.6 39.08,31.67 39.02,31.72 38.95,31.74 38.87,31.76 38.77,31.76 38.72,31.75 38.65,31.72 38.56,31.69 38.51,31.65 38.44,31.59 38.4,31.54 38.37,31.48 38.13,30.07 37.8,30.07 38.04,31.36 38.05,31.44 38.05,31.52 38.02,31.6 37.99,31.67 37.94,31.71 37.79,31.75 37.73,31.75 37.65,31.74 37.57,31.72 37.5,31.7 37.44,31.67 37.37,31.62 37.31,31.57 37.27,31.51 37.24,31.45 37,30.07
  pour Top: 41.12,31.88 40.98,31.61 40.93,31.66 40.88,31.7 40.79,31.74 40.7,31.76 40.62,31.76 40.53,31.77 40.47,31.75 40.39,31.71 40.34,31.66 40.29,31.61 40.27,31.53 40.27,31.46 40.3,31.38 40.34,31.32 40.39,31.28 40.59,31.15 40.76,31.06 40.86,30.99 40.93,30.9 40.97,30.77 40.98,30.68 40.98,30.58 40.96,30.47 40.91,30.37 40.86,30.29 40.78,30.21 40.67,30.14 40.58,30.09 40.46,30.06 40.33,30.04 40.11,30.04 40.01,30.05 39.92,30.09 39.83,30.12 39.69,30.19 39.85,30.45 39.92,30.4 40.03,30.33 40.16,30.29 40.35,30.27 40.46,30.31 40.55,30.37 40.61,30.44 40.67,30.54 40.67,30.68 40.63,30.77 40.54,30.85 40.44,30.91 40.13,31.1 40.01,31.22 39.96,31.31 39.94,31.4 39.95,31.53 39.97,31.66 40.04,31.75 40.13,31.84 40.23,31.92 40.35,31.97 40.51,32.02 40.61,32.04 40.71,32.03 40.84,32 40.96,31.96
FLEXRADIO
  Top 0.102: 41.48,32.02 41.48,32.56 41.55,32.56 41.64,32.56 41.69,32.54 41.73,32.5 41.74,32.46 41.75,32.41 41.72,32.37 41.7,32.34 41.66,32.31 41.52,32.31
GND  (via drill 0.25, 1.27)
  Top 0.254: LDO_7.4 30.37,129.84 LDO_7.P5 | C82.GND3 35.56,130.32 C82.GND7 | C82.GND6 35.26,132.27 C82.GND2 | C83.GND8 27.22,130.24 C83.GND3 | C83.GND5 27.22,132.39 C83.GND2 | C87.GND6 60.94,132.62 C87.GND2 | C87.GND7 60.94,130.47 C87.GND3 | LDO_8.4 64.68,129.81 LDO_8.P5 | C86.GND3 69.98,130.43 70.1,130.56 70.1,130.09 C86.GND8 | C86.GND5 70.28,132.16 C86.GND2 | C91.GND7 96.32,130.62 C91.GND3 | C91.GND6 96.32,132.77 C91.GND2 | LDO_9.4 100.17,129.76 LDO_9.P5 | C90.GND5 105.79,132.19 C90.GND2 | C90.GND8 105.79,130.04 C90.GND3 | C69.GND8 25.19,100.3 C69.GND3 | C69.GND5 25.19,102.45 C69.GND2 | LDO_4.4 28.84,100.14 LDO_4.P5 | C68.GND5 34.9,103.18 C68.GND2 | C68.GND8 34.9,101.03 C68.GND3 | C75.GND6 65.74,102.19 C75.GND2 | C75.GND7 65.74,100.04 C75.GND3 | LDO_5.4 69.23,99.63 LDO_5.P5 | C74.GND8 75.86,100.5 C74.GND3 | C74.GND5 75.86,102.65 C74.GND2 | C79.GND7 103.84,99.79 C79.GND3 | C79.GND6 103.84,101.94 C79.GND2 | LDO_6.4 108.09,99.13 LDO_6.P5 | C78.GND5 115.06,102.17 C78.GND2 | C78.GND8 115.06,100.02 C78.GND3 | C56.GND6 42.85,65.67 C56.GND2 | C56.GND7 42.85,63.52 C56.GND3 | LDO_1.4 47.36,63.36 LDO_1.P5 | C55.GND6 53.17,65.72 C55.GND2 | C55.GND7 53.17,63.57 C55.GND3 | C61.GND7 86.03,63.72 C61.GND3 | C61.GND6 86.03,65.87 C61.GND2 | LDO_2.4 89.78,63.06 LDO_2.P5 | C60.GND8 96.06,63.29 C60.GND3 | C60.GND5 96.06,65.44 C60.GND2 | C65.GND5 132.86,66.63 C65.GND2 | C65.GND8 132.86,64.48 C65.GND3 | LDO_3.4 136.46,63.11 LDO_3.P5 | C64.GND5 143.28,65.52 C64.GND2 | C64.GND8 143.28,63.37 C64.GND3 | C95.GND6 67.01,30.46 C95.GND2 | C95.GND7 67.01,28.31 C95.GND3 | LDO_10.4 71.21,28.11 LDO_10.P5 | C94.GND7 76.94,29 C94.GND3 | C94.GND6 76.94,31.15 C94.GND2 | C99.GND5 131.19,30.21 C99.GND2
  Top 0.254: C99.GND8 131.19,28.06 C99.GND3 | LDO_11.4 134.23,27.45 LDO_11.P5 | C98.GND5 141.09,29.83 C98.GND2 | C98.GND8 141.09,27.68 C98.GND3 | C459.GND2 C459.GND3 | C459.GND4 C459.GND1
  other vias: 6.6,38.48 9.14,38.48 11.68,38.48 14.22,38.48 16.76,38.48 19.3,38.48 25.43,65.71 25.43,61.9 25.43,58.09 25.43,54.28 23.52,52.37 23.52,56.18 23.52,59.99 23.52,63.8 21.62,65.71 21.62,61.9 21.62,58.09 21.62,54.28 21.62,50.47 19.71,48.56 19.71,52.37 19.71,56.18 19.71,59.99 19.71,63.8 17.81,61.9 17.81,58.09 17.81,54.28 17.81,50.47 21.84,38.48 24.38,38.48 26.92,38.48 29.46,38.48 32,38.48 34.54,38.48 37.08,38.48 39.62,38.48 42.8,38.48 45.34,38.48 47.88,38.48 50.42,38.48 52.96,38.48 55.5,38.48 58.04,38.48 60.58,38.48 63.12,38.48 65.66,38.48 68.2,38.48 70.74,38.48 73.28,38.48 75.82,38.48 78.36,38.48 80.9,38.48 83.44,38.48 85.98,38.48 88.52,38.48 91.06,38.48 93.6,38.48 96.14,38.48 98.68,38.48 101.22,38.48 103.76,38.48 106.3,38.48 108.84,38.48 111.38,38.48 113.92,38.48 116.46,38.48 119,38.48 121.54,38.48 124.08,38.48 126.62,38.48 129.16,38.48 131.7,38.48 134.24,38.48 136.78,38.48 139.32,38.48 141.86,38.48 144.4,38.48 146.94,38.48 149.48,38.48 152.02,38.48 154.56,38.48 157.1,38.48 159.64,38.48 162.18,38.48 164.72,38.48 167.26,38.48 169.8,38.48 155.19,46.48 156.97,45.34 158.75,46.48 136.14,52.83 134.62,54.23 133.1,52.83 120.9,46.48 124.59,46.48 122.68,44.83 89.26,52.58 90.81,53.75 92.35,52.58 77.72,46.99 81.03,46.99 79.38,45.34 58.42,19.1 60.1,20.37 58.72,20.35 61.44,20.35 121.67,20.12 121.87,21.13 123.29,21.16 124.71,21.13 37.85,56.64 37.97,57.91 39.37,57.91 40.64,57.91 79.76,56.39 79.88,57.66 81.28,57.66 82.8,57.66 123.7,56.9 126.75,58.17 125.35,58.17 123.95,58.17 15.49,92.23 15.9,93.4 17.83,93.4 19.68,93.4 55.88,91.72 56.29,93.01 58.04,93.04 59.79,93.04 95.25,91.72 95.63,93.12 97.36,93.14 99.03,93.14 16,122.3 17.65,123.95 21.08,122.3 19.56,123.95 51.56,122.3 51.69,123.95 53.09,123.95 54.51,123.93 87.12,122.3 87.25,123.95 88.9,123.9 90.32,123.85 23.62,123.95 21.59,123.95 15.75,123.95 55.93,123.93 57.23,123.9 56.46,122.38 91.72,123.9 92.05,122.33 93.01,123.9 21.29,93.34 20.37,92.18 61.52,93.01 60.73,91.72 100.61,93.14 100.1,91.72 62.97,20.35 62.76,19.08 126.21,21.13 126.11,19.86 128.27,58.17 128.27,56.9 84.33,57.66 84.33,56.39 42.16,57.91 42.42,56.64 5.33,107.06 7.87,107.06 10.41,107.06 12.95,107.06 15.49,107.06 18.03,107.06 20.57,107.06 23.11,107.06 25.65,107.06 28.19,107.06 30.73,107.06 33.27,107.06 35.81,107.06 38.35,107.06 41.53,107.06 44.07,107.06 46.61,107.06 49.15,107.06 51.69,107.06 54.23,107.06 56.77,107.06 59.31,107.06 61.85,107.06 64.39,107.06 66.93,107.06 69.47,107.06 72.01,107.06 74.55,107.06 77.09,107.06 79.63,107.06 82.17,107.06 84.71,107.06 87.25,107.06 89.79,107.06 92.33,107.06 94.87,107.06 97.41,107.06 99.95,107.06 102.49,107.06 105.03,107.06 107.57,107.06 110.11,107.06 112.65,107.06 115.19,107.06 117.73,107.06 120.27,107.06 122.81,107.06 125.35,107.06 127.89,107.06 130.43,107.06 132.97,107.06 135.51,107.06 138.05,107.06 140.59,107.06 178.31,112.78 180.34,111.25 176.28,111.25 158.5,124.97 156.95,123.65 158.5,122.43 156.97,120.9 167.64,127.51 165.61,136.65 167.64,133.6 167.64,135.64 142.75,125.48 147.83,125.48 151.89,120.4 153.92,122.94 149.86,122.94 162.56,130.05 162.56,128.52 162.56,127 164.59,127 164.41,123.32 161.29,115.54 178.28,118.26 177.8,124.97 173.56,111.15 161.04,119.38 5.33,74.47 7.87,74.47 10.41,74.47 12.95,74.47 15.49,74.47 18.03,74.47 20.57,74.47 23.11,74.47 25.65,74.47 28.19,74.47 30.73,74.47 33.27,74.47 35.81,74.47 38.35,74.47 41.53,74.47 44.07,74.47 46.61,74.47 49.15,74.47 51.69,74.47 54.23,74.47 56.77,74.47 59.31,74.47 61.85,74.47 64.39,74.47 66.93,74.47 69.47,74.47 72.01,74.47 74.55,74.47 77.09,74.47 79.63,74.47 82.17,74.47 84.71,74.47 87.25,74.47 89.79,74.47 92.33,74.47 94.87,74.47 97.41,74.47 99.95,74.47 102.49,74.47 105.03,74.47 107.57,74.47 110.11,74.47 112.65,74.47 115.19,74.47 117.73,74.47 120.27,74.47 122.81,74.47 125.35,74.47 127.89,74.47 130.43,74.47 132.97,74.47 135.51,74.47 138.05,74.47 140.59,74.47 143.13,74.47 145.67,74.47 148.21,74.47 150.75,74.47 153.29,74.47 49.4,53.98 50.8,52.58 47.75,52.58 124.84,9.27 61.09,9.53 43.05,46.99 84.2,46.99 128.37,47.24 99.01,82.27 58.9,82.17 18.64,83.44 19.61,114.4 54.31,114.43 90.65,114.4 35.81,127 34.57,125.76 33.27,127 70.1,126.82 67.79,126.77 68.83,125.73 105.89,126.67 104.75,125.73 103.66,126.7 34.8,97.79 32.26,97.79 33.53,96.57 75.69,97.79 74.17,96.39 72.9,97.79 114.55,97.03 112.01,97.03 113.28,95.5 50.8,60.71 53.34,60.71 52.07,59.44 95.5,59.94 94.23,58.78 92.96,59.94 140.21,60.2 143.26,60.2 141.73,58.93 77.47,25.4 74.68,25.4 76.07,24.13 137.67,24.64 140.72,24.64 139.19,23.47 171.45,117.6 171.45,118.36 148.59,46.99 152.15,46.99 152.15,51.82 148.59,51.82 150.37,49.02 104.65,51.82 108.46,51.82 106.68,49.02 108.46,46.99 104.65,46.99 66.55,46.99 62.99,46.99 62.99,51.82 66.8,51.82 64.77,49.02 37.85,80.26 41.4,80.26 41.4,85.34 37.85,85.34 39.62,82.3 77.72,80.26 81.53,80.26 81.53,85.34 77.72,85.34 79.76,82.3 117.09,85.09 120.9,85.09 120.9,80.01 117.09,80.01 119,82.17 134.37,85.09 137.92,85.09 137.92,80.01 134.37,80.01 35.05,117.35 39.5,117.35 39.5,112.78 35.05,112.78 37.34,112.78 37.34,117.35 73.03,112.78 70.74,112.78 75.31,112.78 75.31,117.35 73.03,117.35 70.61,117.35 108.46,112.78 110.74,112.78 106.43,112.78 106.17,117.35 108.46,117.35 110.74,117.35 119.89,112.78 122.17,112.78 124.21,112.78 124.21,117.35 122.17,117.35 119.89,117.35 146.81,52.83 146.81,48.26 134.62,114.17 137.67,114.17 140.72,114.17 143.13,114.05 144.78,112.27 146.81,110.24 148.84,108.2 150.88,106.17 150.88,103.63 151.64,99.57 154.43,96.65 157.48,97.79 154.43,97.79 153.8,100.46 152.91,103.63 152.91,106.68 150.88,109.22 148.84,111.25 146.81,113.28 144.27,115.7 140.72,115.95 137.67,115.95 134.62,115.95 154.43,94.87 151.38,94.87 148.34,94.87 146.05,93.47 146.05,90.42 146.05,87.38 151.38,96.65 148.34,96.65 145.03,96.52 144.02,93.47 144.02,90.42 144.02,87.38 159.51,99.06 162.05,99.06 164.59,99.06 167.13,99.06 163.07,97.54 164.08,96.52 163.07,95.5 164.08,94.49 163.07,93.47 164.08,92.46 163.07,91.44 159.51,89.92 162.05,89.92 164.59,89.92 167.13,89.92 168.66,91.44 168.66,93.47 168.66,95.5 168.66,97.54 128.27,132.84 178.56,27.94 178.56,30.23 178.56,32.51 178.56,34.8 178.56,37.08 178.56,39.37 178.56,41.66 178.56,43.94 178.56,46.48 178.56,49.02 178.56,51.56 178.56,54.1 178.56,56.64 178.56,59.18 176.02,51.56 176.02,49.02 176.02,46.48 176.02,43.94 176.02,41.66 176.02,39.37 176.02,37.08 176.02,34.8 176.02,32.51 176.02,30.23 176.02,27.94 178.56,61.72 178.56,64.26 178.56,66.8 178.31,69.34 177.29,70.36 175.01,72.64 172.72,74.93 170.43,77.22 168.4,79.25 166.37,81.28 164.34,83.31 162.31,85.34 160.53,83.82 162.56,81.79 164.59,79.76 166.62,77.72 168.66,75.69 170.94,73.41 173.23,71.12 175.51,68.83 176.02,66.8 176.02,64.26 176.02,61.72 176.02,59.18 176.02,56.64 176.02,54.1 159.77,85.34 159.77,87.63 162.05,87.63 157.48,96.65 155.45,87.38 153.42,87.38 155.96,93.47 153.92,91.44 155.96,90.42 157.48,91.95 155.45,84.33 153.42,84.33 157.48,81.79 155.96,80.26 160.02,79.25 158.5,77.72 161.04,75.18 163.58,72.64 165.1,70.1 162.56,76.71 165.1,74.17 167.39,71.37 165.1,67.06 167.39,67.06 167.39,64.01 165.1,64.01 165.1,60.96 165.1,57.91 165.1,54.86 167.39,54.86 167.39,57.91 167.39,60.96 159,94.49 157.48,94.49 157.48,99.82 152.15,8.13 153.67,6.6 155.96,6.6 157.48,8.13 155.45,16 151.89,16 153.67,17.53 164.85,16 161.29,16 163.07,17.53 161.29,8.13 163.07,6.6 165.61,6.6 167.13,8.13 169.67,8.13 171.2,6.86 108.71,8.38 110.24,6.6 106.17,8.13 100.08,8.13 101.85,6.6 104.39,6.6 96.27,8.13 90.17,8.13 91.95,6.6 94.49,6.6 103.63,16 100.08,16 101.85,17.53 93.73,16.26 90.17,16.26 91.95,17.78 46.23,6.86 44.45,8.38 41.91,8.38 40.13,6.86 37.85,6.86 36.07,8.38 39.62,16.26 36.07,16.26 37.85,17.78 29.21,16.51 25.65,16.51 27.43,18.03 32,8.38 30.23,6.86 27.43,6.86 25.65,8.38 48.01,8.38 112.01,8.38 172.97,8.13 176.02,25.65 176.02,23.37 176.02,20.57 178.56,25.65 178.56,23.37 178.31,20.57 178.31,17.53 176.28,17.53
  pour Top: 105.79,50.16 103.76,50.16 103.76,52.2 109.35,52.2 109.35,50.16 107.31,50.16 107.31,48.51 109.35,48.51 109.35,46.61 103.76,46.61 103.76,48.64 105.79,48.64
  pour Top: 15.14,60.76 21.87,66.73 28.22,66.73 28.22,53.39 23.14,48.31 15.14,48.31
  pour Top: 64.14,50.29 62.1,50.29 62.1,52.07 67.44,52.07 67.44,50.29 65.41,50.29 65.41,48.51 67.44,48.51 67.44,46.74 62.1,46.74 62.1,48.51 64.14,48.51
  pour Top: 149.73,50.29 147.7,50.29 147.7,52.07 153.03,52.07 153.03,50.29 151,50.29 151,48.51 153.03,48.51 153.03,46.74 147.7,46.74 147.7,48.51 149.73,48.51
  pour Top (isolate 0.254): 162.18,45.47 162.18,53.59 170.31,53.59 170.31,45.47
  pour Top (isolate 0.254): 5.97,68.83 13.84,68.83 13.84,60.71 5.97,60.71
  pour Top (isolate 0.254): 141.1,86.64 148.97,86.64 148.97,78.51 141.1,78.51
  pour Top (isolate 0.254): 5.36,88.06 13.23,88.06 13.23,80.19 5.36,80.19
  pour Top (isolate 0.254): 4.88,16.54 13,16.54 12.75,8.41 4.88,8.41
  pour Top (isolate 0.254): 5.97,119.13 14.1,119.13 14.1,111 5.97,111
  pour Top: 123.32,9.58 124.46,9.58 124.46,10.46 126.36,10.46 126.36,9.19 125.22,9.19 125.22,8.18 123.32,8.18
  pour GND (isolate 0.508, no thermals): 0,0 182.63,-1.27 182.88,137.77 -1.52,137.52 -0.25,0.25
  pour Top: 4.32,40.49 171.32,40.49 171.32,36.53 4.32,36.55
  pour Top (isolate 0.254): 48.51,16.05 56.13,16.05 56.13,8.43 48.51,8.43
  pour Top (isolate 0.254): 70.61,16.05 78.23,16.05 78.23,8.43 70.61,8.43
  pour Top (isolate 0.254): 112.52,15.93 120.14,15.93 120.14,8.31 112.52,8.31
  pour Top (isolate 0.254): 133.35,16.05 140.97,16.05 140.97,8.43 133.35,8.43
  pour Top (isolate 0.254): 173.1,16.05 181.36,16.05 181.36,8.43 173.1,8.43
  pour Top (isolate 0.254): 30.35,53.72 38.61,53.72 38.61,45.47 30.35,45.47
  pour Top (isolate 0.254): 51.94,53.72 60.2,53.72 60.2,45.47 51.94,45.47
  pour Top (isolate 0.254): 69.09,53.72 77.09,53.72 77.09,45.47 69.09,45.47
  pour Top (isolate 0.254): 93.85,53.72 101.47,53.72 101.47,45.47 93.85,45.47
  pour Top (isolate 0.254): 111.63,53.72 119.63,53.72 119.63,45.47 111.63,45.47
  pour Top (isolate 0.254): 137.03,53.72 145.29,53.72 145.29,45.47 137.03,45.47
  pour Top (isolate 0.254): 26.67,86.51 34.29,86.51 34.29,78.89 26.67,78.89
  pour Top (isolate 0.254): 44.45,86.51 52.7,86.51 52.7,78.89 44.45,78.89
  pour Top (isolate 0.254): 66.67,86.51 74.3,86.51 74.3,78.89 66.67,78.89
  pour Top (isolate 0.254): 84.45,86.51 92.08,86.51 92.08,78.89 84.45,78.89
  pour Top (isolate 0.254): 106.05,86.26 114.3,86.26 114.3,78.64 106.05,78.64
  pour Top (isolate 0.254): 123.83,86.39 131.44,86.39 131.44,78.77 123.83,78.77
  pour Top (isolate 0.254): 26.16,118.87 34.16,118.87 34.16,111.25 26.16,111.25
  pour Top (isolate 0.254): 40.26,118.87 48.26,118.87 48.26,111.25 40.26,111.25
  pour Top (isolate 0.254): 62.36,118.87 69.98,118.87 69.98,111.25 62.36,111.25
  pour Top (isolate 0.254): 97.79,118.87 105.41,118.87 105.41,111.25 97.79,111.25
  pour Top (isolate 0.254): 111.51,118.87 119.13,118.87 119.13,111.25 111.51,111.25
  pour Top (isolate 0.254): 125.22,118.87 132.84,118.87 132.84,111.25 125.22,111.25
  pour Top: 36.96,85.5 42.29,85.5 42.29,80.16 36.96,80.16
  pour Top: 76.96,85.5 82.3,85.5 82.3,80.16 76.96,80.16
  pour Top: 116.59,85.24 121.54,85.24 121.54,79.91 116.59,79.91
  pour Top: 133.73,85.24 138.68,85.24 138.68,79.91 133.73,79.91
  pour Top: 34.92,117.47 39.62,117.47 39.62,112.65 34.92,112.65
  pour Top: 70.61,117.47 75.44,117.47 75.44,112.65 70.61,112.65
  pour Top: 106.05,117.47 110.87,117.47 110.87,112.65 106.05,112.65
  pour Top: 119.76,117.47 124.33,117.47 124.33,112.65 119.76,112.65
  pour Top: 132.59,51.56 132.59,54.61 136.65,54.61 136.65,51.56
  pour Top: 154.94,48.01 159,48.01 159,44.96 154.94,44.96
  pour Top: 77.22,48.01 81.53,48.01 81.53,44.96 77.22,44.96
  pour Top: 93.22,51.31 88.65,51.31 88.65,54.1 93.22,54.1
  pour Top: 120.4,47.75 125.22,47.75 125.22,44.2 120.4,44.2
  pour Top: 57.91,18.08 65.79,18.08 65.79,20.88 57.91,20.88
  pour Top: 121.16,18.85 129.29,18.85 129.29,21.64 121.16,21.64
  pour Top: 125.22,55.88 123.19,55.88 123.19,58.67 131.06,58.67 131.06,55.63
  pour Top: 37.34,55.63 37.34,58.42 44.7,58.42 44.7,55.63
  pour Top: 86.87,55.37 79.25,55.37 79.25,58.17 86.87,58.17
  pour Top: 51.56,51.31 46.99,51.31 46.99,54.61 51.56,54.61
  pour Top: 55.37,90.7 64.26,90.7 64.26,93.5 55.37,93.5
  pour Top: 14.99,90.96 23.62,90.96 23.62,93.88 14.99,93.88
  pour Top: 94.74,90.58 103.38,90.58 103.38,93.62 94.74,93.62
  pour Top: 15.49,121.16 24.51,121.16 24.51,124.33 15.49,124.33
  pour Top: 51.05,121.16 59.56,121.16 59.56,124.33 51.05,124.33
  pour Top: 86.61,121.16 95.38,121.16 95.38,124.33 86.61,124.33
  pour Top (isolate 0.254): 76.45,118.87 84.07,118.87 84.07,111.25 76.45,111.25
  pour Top (isolate 0.254): 19.1,114.66 19.1,115.67 20.88,115.67 20.88,113.89 20.12,113.89 20.12,113.13 18.34,113.13 18.34,114.66
  pour Top: 3,108.81 141.86,108.81 141.86,105.38 3,105.36
  pour Top: 175.77,110.24 175.77,113.28 180.85,113.28 180.85,110.24
  pour Top (isolate 0.254, rank 2): 159.51,118.36 159.51,125.48 156.46,125.48 156.46,118.36
  pour Top (isolate 0.254, rank 3): 169.16,128.02 167.13,128.02 167.13,127 169.16,127
  pour Top (isolate 0.254, rank 3): 165.1,135.13 165.1,137.16 168.15,137.16 168.15,132.59 165.61,132.59 165.61,135.13
  pour Top (isolate 0.254, rank 2): 151.89,125.48 154.43,125.48 154.43,119.89 149.35,119.89 149.35,125.48
  pour Top (isolate 0.254, rank 3): 142.24,126.49 148.34,126.49 148.34,124.46 142.24,124.46
  pour Top (isolate 0.254, rank 3): 159.51,132.08 161.54,132.08 163.58,130.05 163.58,126.49 159.51,126.49
  pour Top (isolate 0.254, rank 2): 163.07,127.51 164.59,127.51 165,127 165,123.44 164.59,122.94 162.56,122.94 162.56,123.44 164.08,123.44 164.59,123.95 164.59,126.49 164.08,127 163.07,127
  pour Top (isolate 0.254, rank 2): 161.09,116.84 165.76,116.84 165.76,114.73 161.06,114.73 161.06,116.81
  pour Top (isolate 0.254, rank 3): 176.28,119.38 178.31,119.38 178.82,118.54 178.82,117.86 178.33,117.5 176.3,117.5
  pour Top (isolate 0.254, rank 3): 175.77,124.97 175.77,125.48 177.8,125.48 178.31,125.48 178.82,124.97 178.31,124.46 175.77,124.46
  pour Top (isolate 0.254, rank 3): 170.18,111.76 173.74,111.76 174.24,111.25 174.24,110.74 169.67,110.74 169.67,111.25
  pour Top (isolate 0.254, rank 2): 163.45,117.88 162.05,117.86 160.53,119.38 159,119.38 159,119.89 161.04,119.89 162.31,118.62 163.47,118.62
  pour Top: 3.05,76.25 155.57,76.25 155.57,72.8 3.05,72.82
  pour Top (isolate 0.254): 59.69,10.41 62.23,10.41 62.23,8.89 59.69,8.89
  pour Top: 44.45,48.01 44.45,45.97 41.66,45.97 41.66,48.01
  pour Top: 85.6,48.01 85.6,45.97 82.8,45.97 82.8,48.01
  pour Top: 129.64,48.26 129.64,46.23 127.1,46.23 127.1,48.26
  pour Top: 19.91,84.33 19.91,82.55 17.37,82.55 17.37,84.33
  pour Top: 60.3,83.06 60.3,81.28 57.51,81.28 57.51,83.06
  pour Top: 97.61,83.16 100.41,83.16 100.41,81.38 97.61,81.38
  pour Top: 52.78,115.44 55.83,115.44 55.83,113.41 52.78,113.41
  pour Top: 89.38,115.42 92.18,115.42 92.18,113.39 89.38,113.39
  pour Top (isolate 0.254): 32.77,127.51 32.77,125.22 36.32,125.22 36.32,127.76 33.02,127.76
  pour Top (isolate 0.254): 67.31,127.76 70.61,127.76 70.61,125.22 67.31,125.22
  pour Top: 103.12,127.76 103.12,125.22 106.48,125.25 106.43,125.73 106.43,127.76
  pour Top: 35.08,98.65 35.05,96.01 32,96.01 32.03,98.65
  pour Top: 72.64,98.3 72.64,95.94 75.95,95.94 75.95,98.3
  pour Top: 111.76,97.54 114.81,97.54 114.81,94.97 111.76,94.97
  pour Top (isolate 0.254): 50.29,61.47 53.85,61.47 53.85,58.93 50.29,58.93
  pour Top: 92.46,60.71 96.01,60.71 96.01,58.37 92.46,58.37
  pour Top: 143.76,60.96 143.76,58.42 139.7,58.42 139.7,60.96
  pour Top: 74.17,26.29 77.98,26.29 77.98,23.62 74.17,23.62
  pour Top: 137.16,25.4 141.22,25.4 141.22,22.86 137.16,22.86
  pour Top: 162.05,127 162.05,124.71 164.08,124.71 164.08,127
  pour Top (isolate 0.254): 170.94,118.87 171.7,118.87 171.96,118.62 171.96,118.11 172.21,117.86 173.23,117.86 173.23,117.09 170.94,117.09
  pour Top (isolate 0.429): 157.99,99.57 157.99,88.9 169.16,88.9 169.16,100.08 157.99,100.08